# Altium project CW330_NewKintexFPGA.PrjPcb (part 1 of 5)
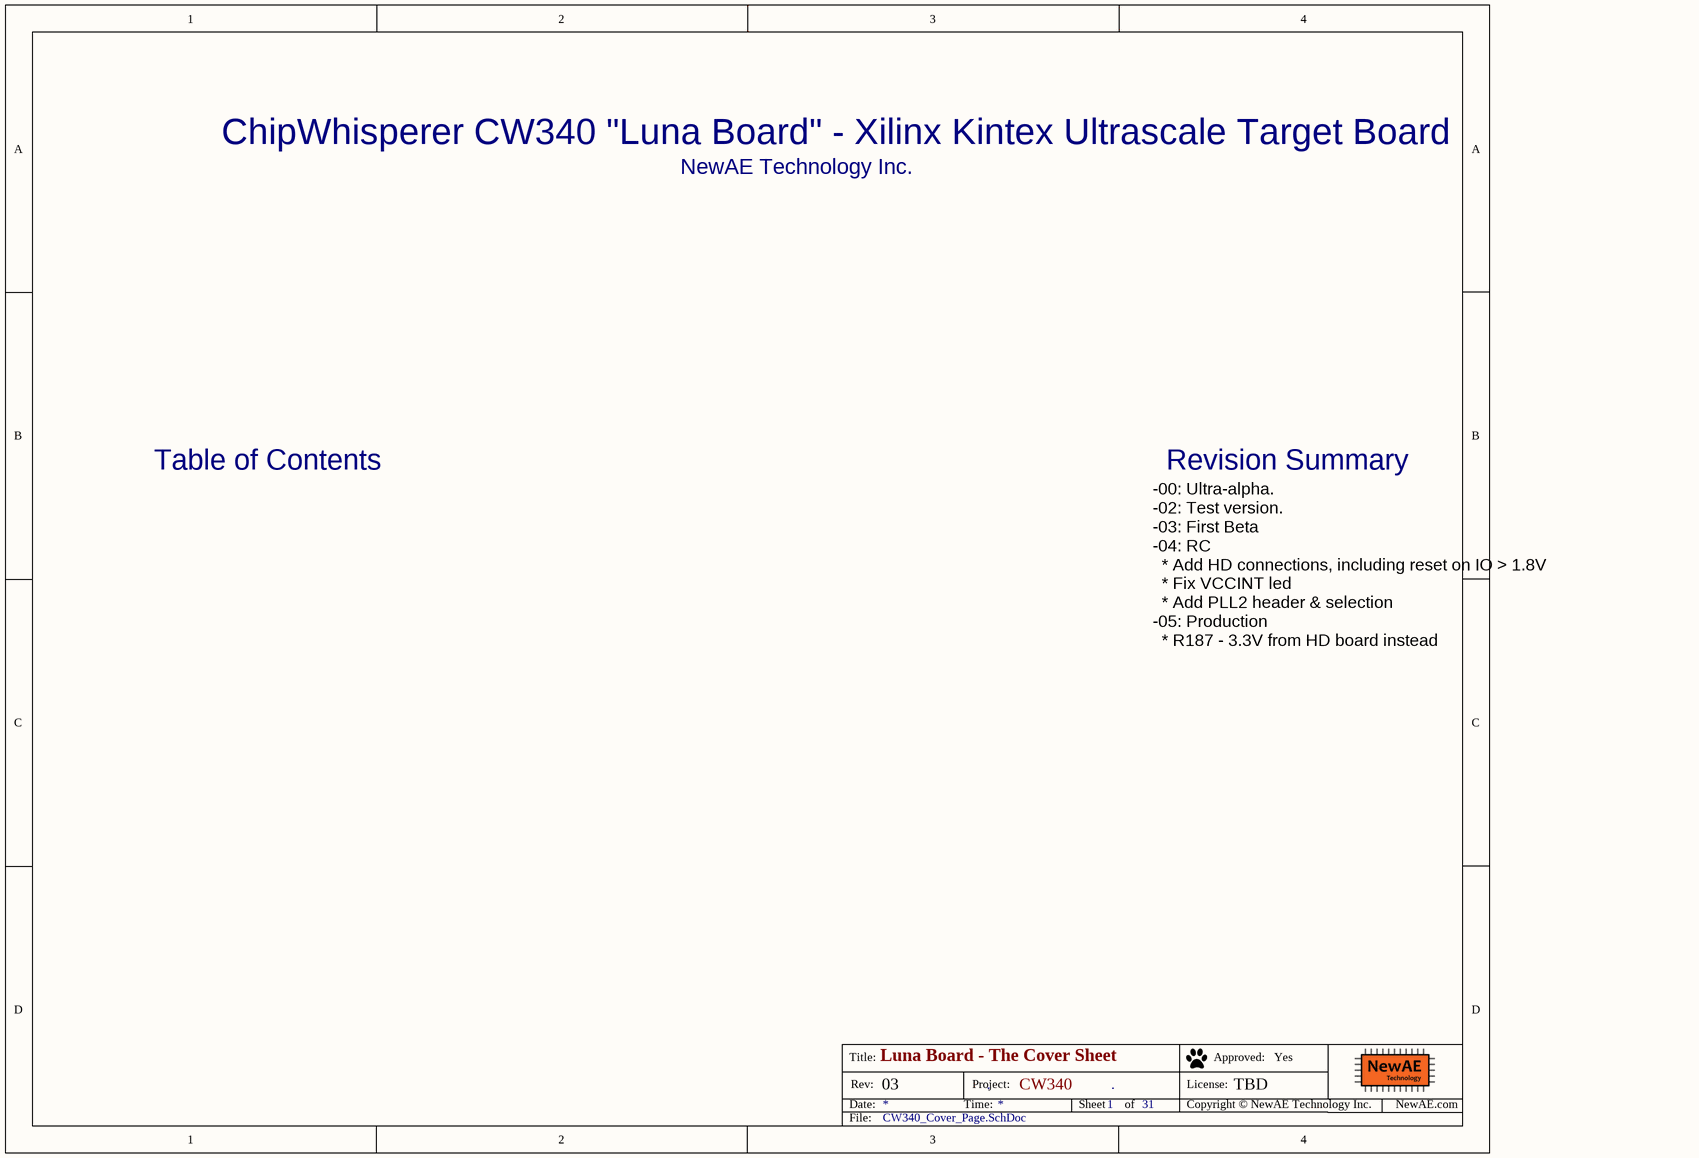
[diagram p0: CW340_Cover_Page.SchDoc]
PrjLicense: TBD; PrjName: CW340; PrjRev: 03
26 sheets, 651 parts. Net scope: global (net labels, ports and power ports of the same name join across sheets).
Board file: NAE_CW340_KintexFPGA.PcbDoc
Sheets:
  CW340_Cover_Page.SchDoc
  CW340_Block_Diagram.SchDoc
  CW340_FPGA_CFG.SchDoc
  CW340_Clocks.SchDoc
  CW340_FPGA_XADC.SchDoc
  CW340_HEATSINK_FAN.SchDoc
  CW340_INPUT_POWER.SchDoc
  CW340_PSU_VCCIO.SchDoc
  CW340_PSU_VCCAUX.SchDoc
  CW340_USBHUB.SchDoc
  CW340_USBHUB_ExtPorts.SchDoc
  CW340_SAM3X_MAIN.SchDoc
  CW340_SAM3X_PWR.SchDoc
  CW340_SAM3X_MISC.SchDoc
  CW340_SAM3X_USB.SchDoc
  CW340_STATUS_LEDs.SchDoc
  CW340_USERIO_debug.SchDoc
  CW340_USERIO_Header.SchDoc
  CW340_USERIO_USB.SchDoc
  CW340_USERIO_SerialSelections.SchDoc
  CW340_USERIO_Breakout.SchDoc
  CW340_SPI_flashes.SchDoc
  CW340_EdgeConnector.SchDoc
  CW340_HyperDebug.SchDoc
  CW340_FTDI.SchDoc
  CW340_FTDI_LevelShifting.SchDoc

## Sheet CW340_Cover_Page.SchDoc: Luna Board - The Cover Sheet
size Letter; DocumentNumber: .; Revision: .; SheetNumber: 1; SheetTotal: 31; SheetApproved: Yes

### Notes on the sheet
- ChipWhisperer CW340 "Luna Board" - Xilinx Kintex Ultrascale Target Board
- NewAE Technology Inc.
- Table of Contents
- Revision Summary
- -00: Ultra-alpha.
  -02: Test version.
  -03: First Beta
  -04: RC
  * Add HD connections, including reset on IO > 1.8V
  * Fix VCCINT led
  * Add PLL2 header & selection
  -05: Production
  * R187 - 3.3V from HD board instead
- Title:
- Date:
- Rev:
- Time:
- Project:
- Sheet
- of
- License:
- Copyright © NewAE Technology Inc.
- Approved:
- NewAE.com
- File:

## Sheet CW340_Block_Diagram.SchDoc: Block Diagram
size Letter; SheetNumber: 2; SheetTotal: 31
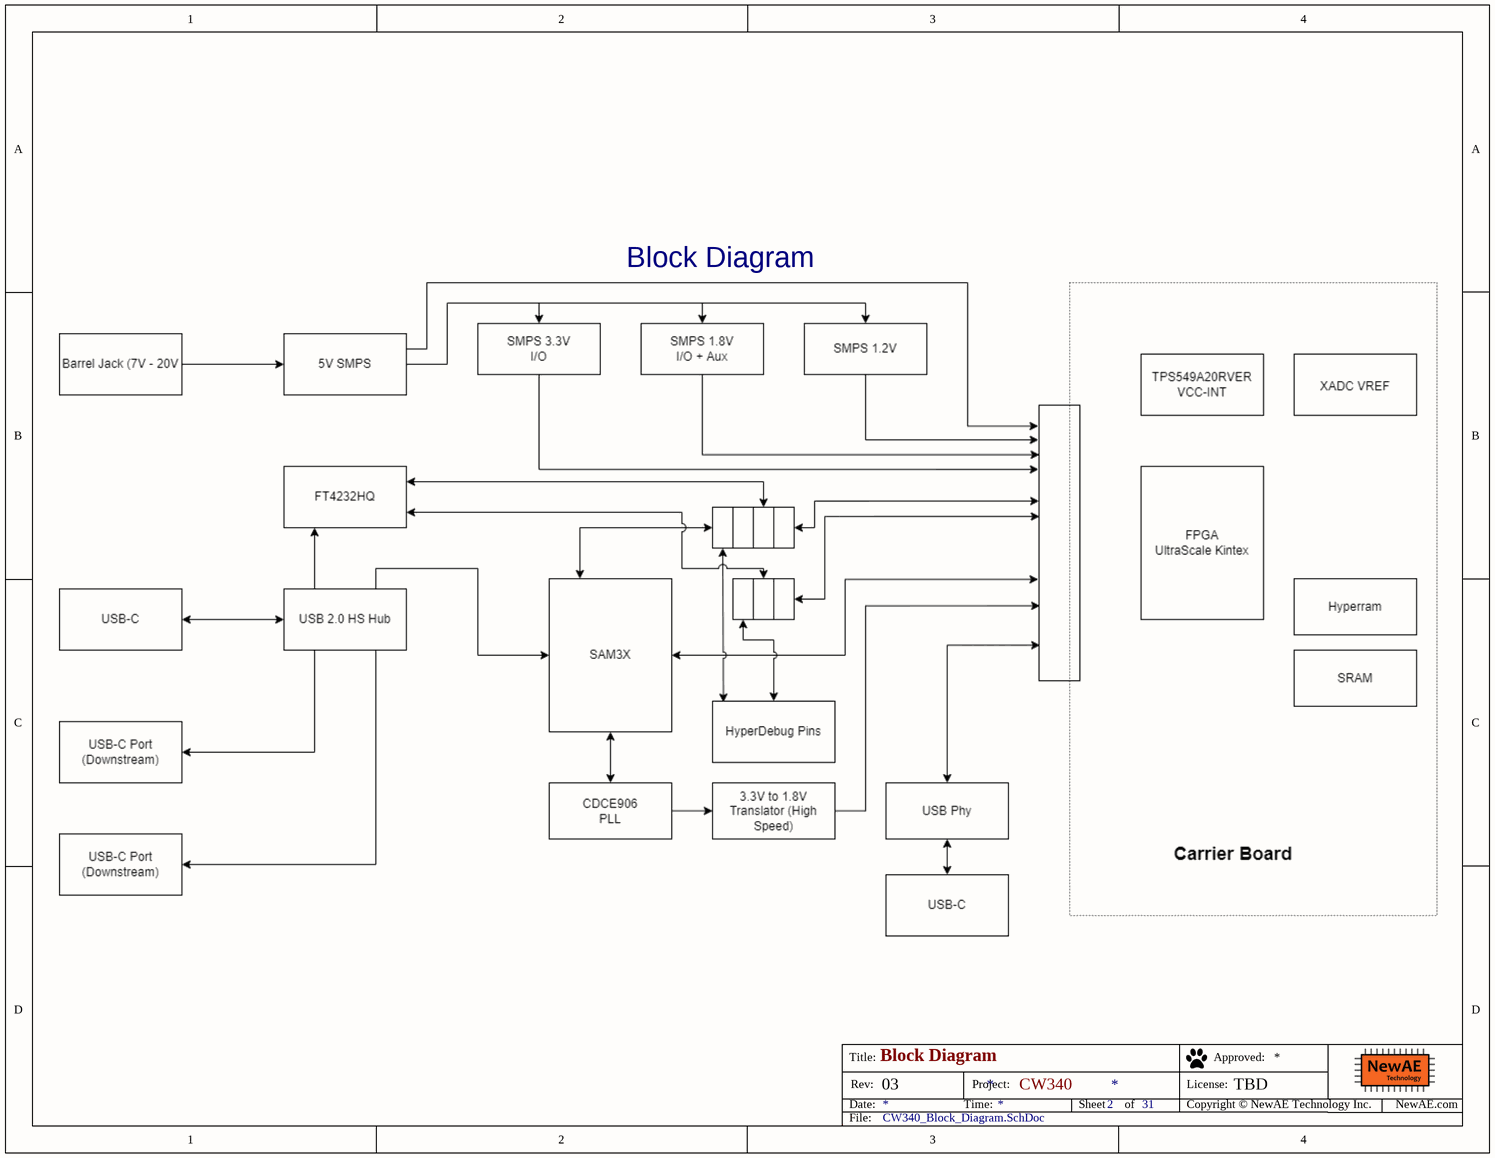
[diagram p1: CW340_Block_Diagram.SchDoc]

### Notes on the sheet
- Block Diagram
- Title:
- Date:
- Rev:
- Time:
- Project:
- Sheet
- of
- License:
- Copyright © NewAE Technology Inc.
- Approved:
- NewAE.com
- File:

## Sheet CW340_FPGA_CFG.SchDoc: Configuration Routing
size Letter; Organization: NewAE Technology Inc.; Address1: 1083 Queen St., Suite 196; Address2: Halifax; Address3: NS; Address4: Canada B3H 0B2; DocumentNumber: .; Revision: .; SheetNumber: 16; SheetTotal: 31; SheetApproved: NO
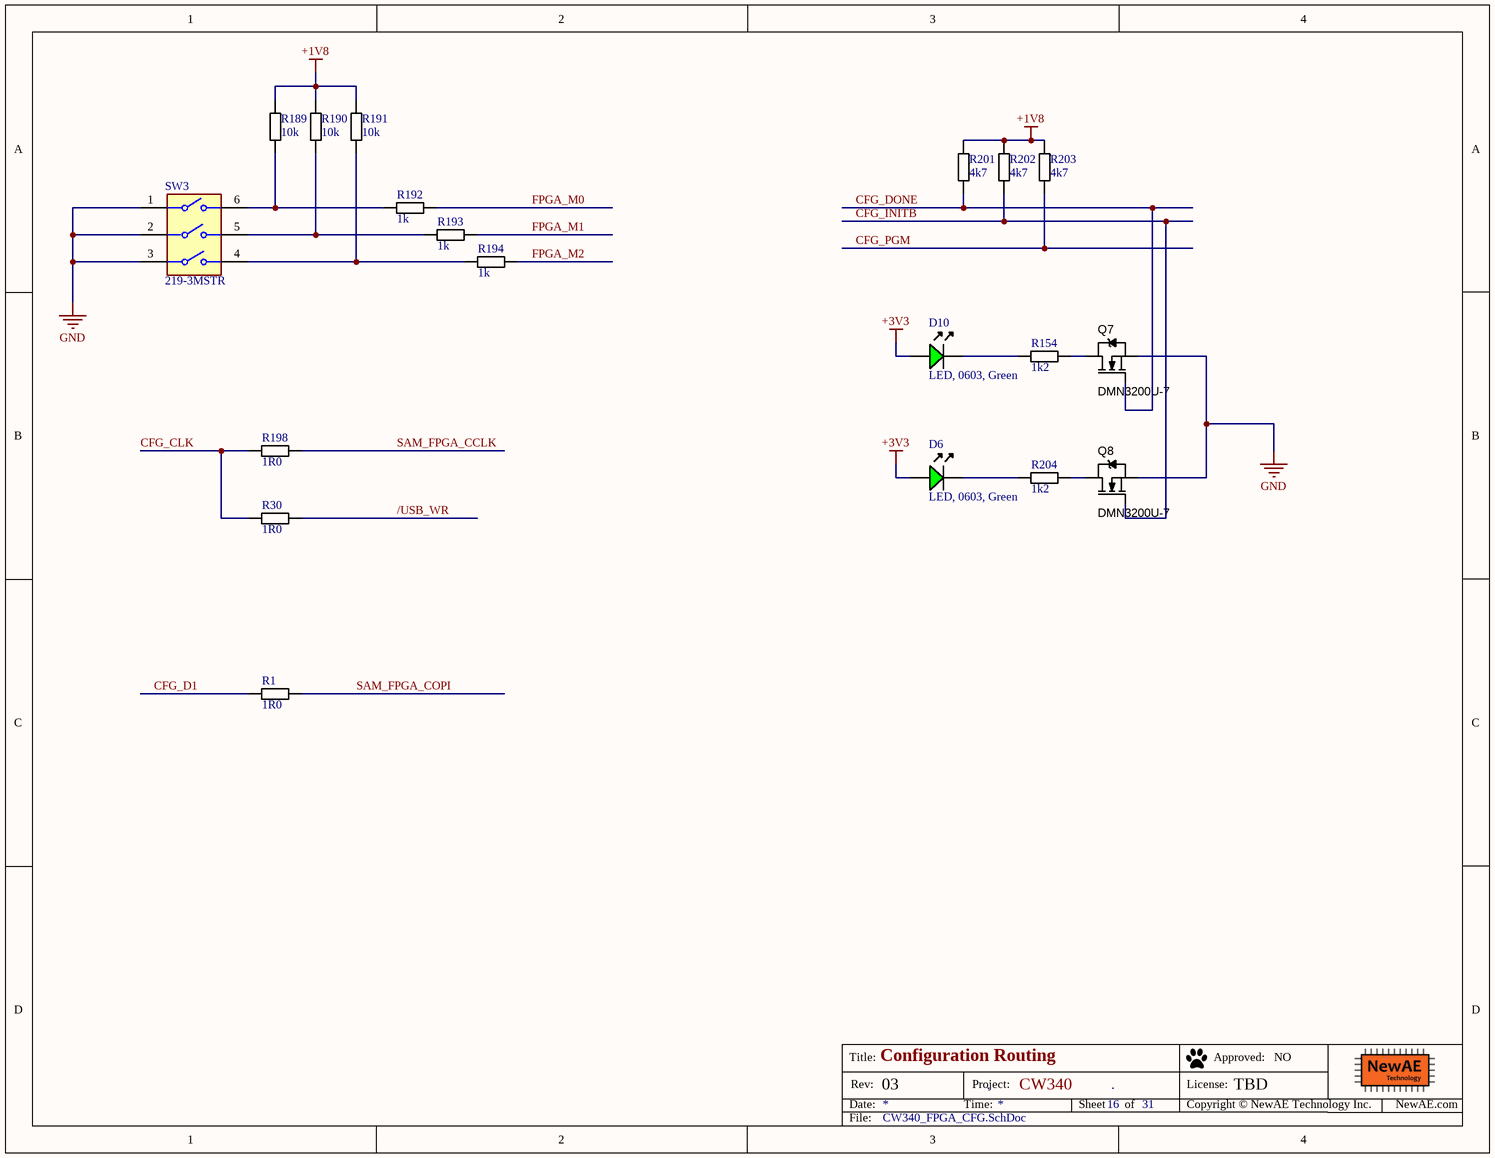
[diagram p2: CW340_FPGA_CFG.SchDoc]

### Parts
D6  LED, 0603, Green  [LED-0603-GREEN]
D10  LED, 0603, Green  [LED-0603-GREEN]
Q7  DMN3200U-7  [SOT95P245X110-3M]
Q8  DMN3200U-7  [SOT95P245X110-3M]
R1  1R0  [RESC1608X55N]
R30  1R0  [RESC1608X55N]
R154  1k2  [RESC1005X40N]
R189  10k  [RESC1005X40N]
R190  10k  [RESC1005X40N]
R191  10k  [RESC1005X40N]
R192  1k  [RESC1005X40N]
R193  1k  [RESC1005X40N]
R194  1k  [RESC1005X40N]
R198  1R0  [RESC1608X55N]
R201  4k7  [RESC1005X40N]
R202  4k7  [RESC1005X40N]
R203  4k7  [RESC1005X40N]
R204  1k2  [RESC1005X40N]
SW3  219-3MSTR  [FP-219-3MSTR-MFG]

### Nets
+1V8: R189.1 R190.1 R191.1 R201.1 R202.1 R203.1
+3V3: D6.A D10.A
GND: Q7.2(S) Q8.2(S) SW3.1 SW3.2 SW3.3
/USB_WR: R30.2
CFG_CLK: R30.1 R198.1
CFG_D1: R1.1
CFG_DONE: Q7.1(G) R201.2
CFG_INITB: Q8.1(G) R202.2
CFG_PGM: R203.2
FPGA_M0: R192.2
FPGA_M1: R193.2
FPGA_M2: R194.2
SAM_FPGA_CCLK: R198.2
SAM_FPGA_COPI: R1.2
NetD6_K: D6.K R204.1
NetD10_K: D10.K R154.1
NetQ7_3: Q7.3(D) R154.2
NetQ8_3: Q8.3(D) R204.2
NetR189_2: R189.2 R192.1 SW3.6
NetR190_2: R190.2 R193.1 SW3.5
NetR191_2: R191.2 R194.1 SW3.4

### Notes on the sheet
- Title:
- Date:
- Rev:
- Time:
- Project:
- Sheet
- of
- License:
- Copyright © NewAE Technology Inc.
- Approved:
- NewAE.com
- File:

### Library data of the parts
D6 D10 = LEDCHIP_0603_GREEN: Chip LED, Green; Manufacture 1: Kingbright; Manufacture Part Number 1: APT1608CGCK; Component Group: Optical; PP Material Stack: 16; PP Rotation: -90; Part Number: LEDCHIP_0603_GREEN; Pin Count: 2; Supplier 1: Digi-Key; Supplier Part Number 1: 754-1116-1-ND; Mounting Technology: SMT; Component Kind: Standard; Component Type: Standard
Q7 Q8 = DMN3200U-7: MOSFET N-CH 30V 2.2A SOT23-3; Manufacture 1: Diodes Inc.; Rated Power: 3A; PP Material Stack: 0; Part Number: DMN3200U-7; Component Group: MOSFET; Footprint: SOT23; Manufacture Part Number 1: DMN3200U-7; Pin Count: 3; Supplier 1: Digi-Key; Supplier Part Number 1: DMN3200U-7DICT-ND; Rated Voltage: 30V; Mounting Technology: SMT; RoHS: Yes; Component Kind: Standard; Component Type: Standard; PP Rotation: 0
R1 R30 R198 = RCHIP-1R0-0603: 1R0 res, 0603, 1%, 1/10W; Manufacture 1: Yageo; Manufacture Part Number 1: RC0603FR-071RL; Component Group: Resistor; Case-EIA: 0603; Case-Metric: 1608; Rated Power: 0.1W; Rated Voltage: 75VDC; Part Number: RCHIP-1R0-0603; Footprint: 0603; Pin Count: 2; Supplier 1: Digi-Key; Supplier Part Number 1: 311-1.00HRCT-ND; Value: 1R0; Tolerance: 1%; Mounting Technology: SMT; Temperature Range: -55C to 155C; Component Kind: Standard; Component Type: Standard
R154 R204 = RCHIP-1K2-0402: 1k2 res, 0402, 1%, 1/16W; Manufacture 1: Yageo; Manufacture Part Number 1: RC0402FR-071K2L; Component Group: Resistor; Case-EIA: 0402; Case-Metric: 1005; Rated Power: 0.063W; Rated Voltage: 75VDC; Part Number: RCHIP-1K2-0402; Footprint: 0402; Pin Count: 2; Supplier 1: Digi-Key; Supplier Part Number 1: 311-1.20KLRCT-ND; Value: 1k2; Tolerance: 1%; Mounting Technology: SMT; Temperature Range: -55C to 155C; Component Kind: Standard; Component Type: Standard
R189-R191 = RCHIP-10K-0402: 10k res, 0402, 1%, 1/16W; Manufacture 1: Yageo; Manufacture Part Number 1: RC0402FR-0710KL; Component Group: Resistor; Case-EIA: 0402; Case-Metric: 1005; Rated Power: 0.063W; Rated Voltage: 75VDC; Part Number: RCHIP-10K-0402; Footprint: 0402; Pin Count: 2; Supplier 1: Digi-Key; Supplier Part Number 1: 311-10.0KLRCT-ND; Value: 10k; Tolerance: 1%; Mounting Technology: SMT; Temperature Range: -55C to 155C; Component Kind: Standard; Component Type: Standard
R192-R194 = RCHIP-1K-0402: 1k res, 0402, 1%, 1/16W; Manufacture 1: Yageo; Manufacture Part Number 1: RC0402FR-071KL; Component Group: Resistor; Case-EIA: 0402; Case-Metric: 1005; Rated Power: 0.063W; Rated Voltage: 75VDC; Part Number: RCHIP-1K-0402; Footprint: 0402; Pin Count: 2; Supplier 1: Digi-Key; Supplier Part Number 1: 311-1.00KLRCT-ND; Value: 1k; Tolerance: 1%; Mounting Technology: SMT; Temperature Range: -55C to 155C; Component Kind: Standard; Component Type: Standard
R201-R203 = RCHIP-4K7-0402: 4k7 res, 0402, 1%, 1/16W; Manufacture 1: Yageo; Manufacture Part Number 1: RC0402FR-074K7L; Component Group: Resistor; Case-EIA: 0402; Case-Metric: 1005; Rated Power: 0.063W; Rated Voltage: 75VDC; Part Number: RCHIP-4K7-0402; Footprint: 0402; Pin Count: 2; Supplier 1: Digi-Key; Supplier Part Number 1: 311-4.7KLRCT-ND; Value: 4k7; Tolerance: 1%; Mounting Technology: SMT; Temperature Range: -55C to 155C; Component Kind: Standard; Component Type: Standard
SW3 = CMP-07018-000004-1: SWITCH SLIDE DIP SPST 100MA 20V; Washable: Yes; Mechanical Life: 2000Cycles; Number of Positions: 3; Pitch: 0.1inch; Actuator Type: Slide (Standard); Max Operating Temperature: 85°C; Voltage Rating (DC): 20V; Termination: Gull Wing; Length: 0.358inch; Min Operating Temperature: -55°C; Orientation: Straight; Mount: Surface Mount; Package Quantity: 1000; Current Rating: 100mA; Electrical Life: 2000Cycles; Max Current Rating: 100mA; Throw Configuration: SPST; Contact Material: Copper; Packaging: Tape and Reel; Contact Plating: Gold; Lead Free: Lead Free; Max Voltage Rating (DC): 20V

## Sheet CW340_Clocks.SchDoc: PLL, Clocks for FPGA
size Letter; DocumentNumber: .; Revision: .; SheetNumber: 29; SheetTotal: 31; SheetApproved: NO
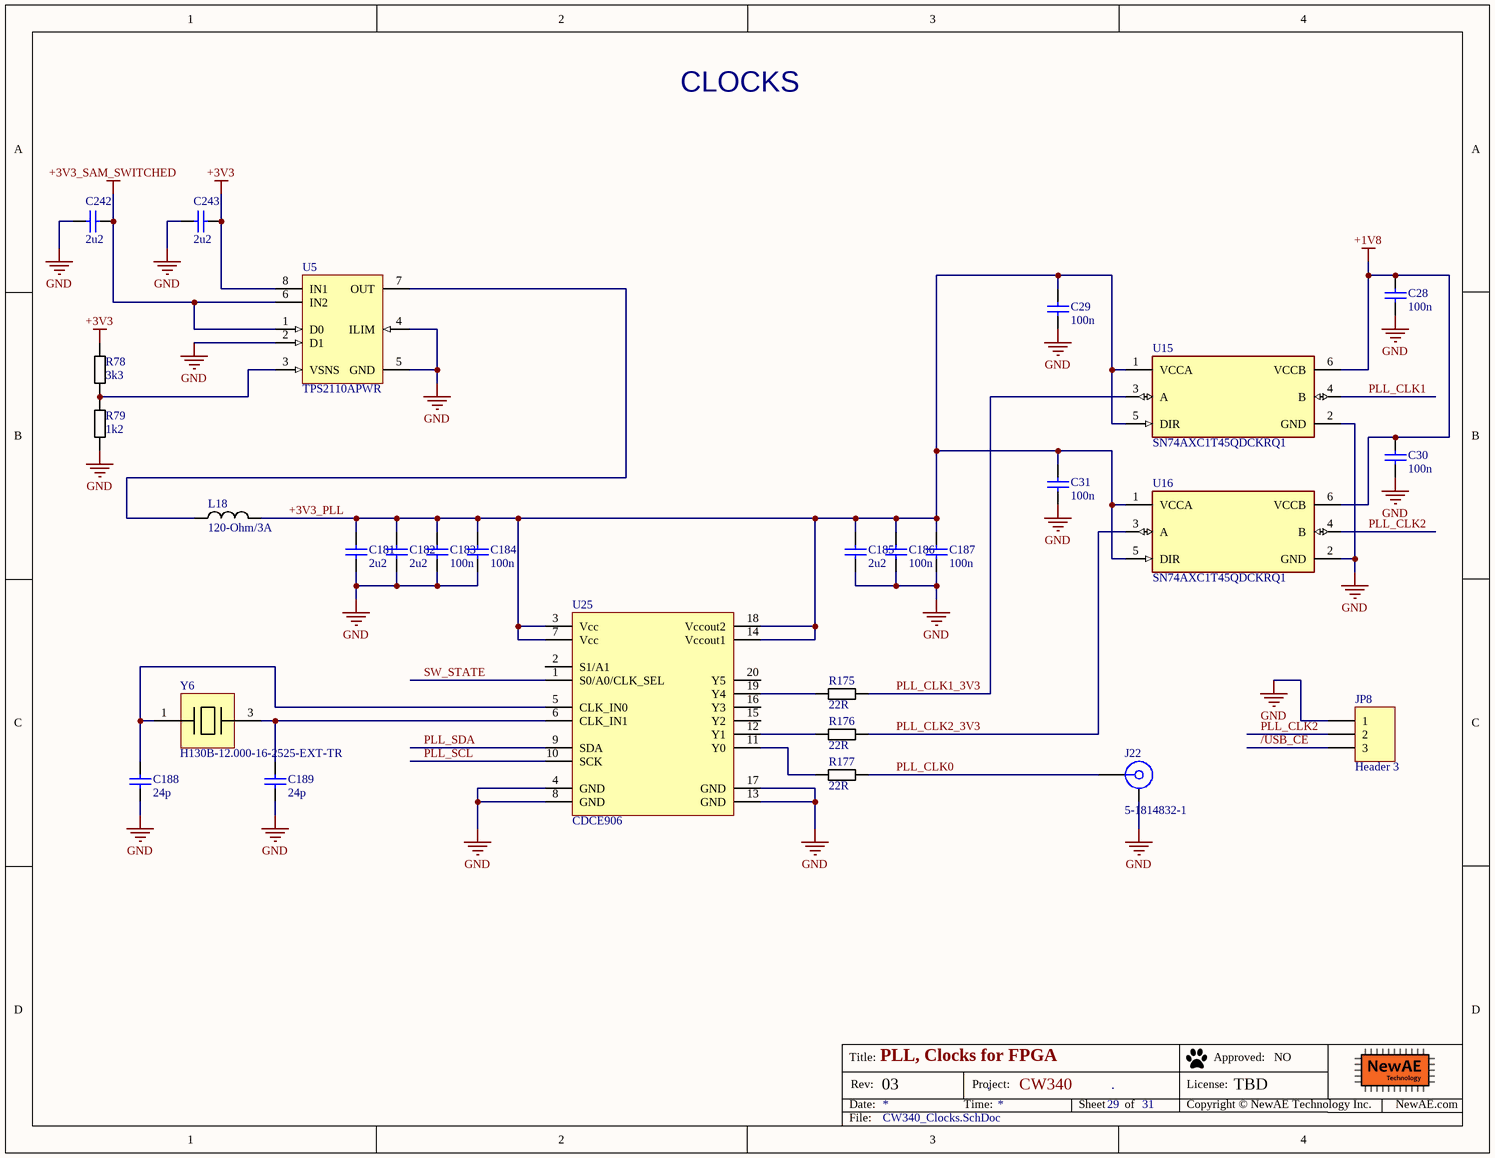
[diagram p3: CW340_Clocks.SchDoc]

### Parts
C28  100n  [CAPC0402_M]
C29  100n  [CAPC0402_M]
C30  100n  [CAPC0402_M]
C31  100n  [CAPC0402_M]
C181  2u2  [CAPC0603_M]
C182  2u2  [CAPC0603_M]
C183  100n  [CAPC0402_M]
C184  100n  [CAPC0402_M]
C185  2u2  [CAPC0603_M]
C186  100n  [CAPC0402_M]
C187  100n  [CAPC0402_M]
C188  24p  [CAPC0402_M]
C189  24p  [CAPC0402_M]
C242  2u2  [CAPC0603_M]
C243  2u2  [CAPC0603_M]
J22  5-1814832-1  [SMA_VERT_1.65MMHOLE]
JP8  Header 3  [HDR1X3]
L18  120-Ohm/3A  [IND_0603]
R78  3k3  [RESC1005X40N]
R79  1k2  [RESC1005X40N]
R175  22R  [RESC1005X40N]
R176  22R  [RESC1005X40N]
R177  22R  [RESC1005X40N]
U5  TPS2110APWR  [PW0008A_L]
U15  SN74AXC1T45QDCKRQ1  [FP-DCK0006A-MFG]
U16  SN74AXC1T45QDCKRQ1  [FP-DCK0006A-MFG]
U25  CDCE906  [TSSOP065-20-PW]
Y6  H130B-12.000-16-2525-EXT-TR  [5x3.2mm XTAL]

### Nets
+1V8: C28.1 C30.1 U15.6(VCCB) U16.6(VCCB)
+3V3: C243.2 R78.1 U5.8(IN1)
+3V3_SAM_SWITCHED: C242.2 U5.1(D0) U5.6(IN2)
GND: C28.2 C29.2 C30.2 C31.2 C181.2 C182.2 C183.2 C184.2 C185.2 C186.2 C187.2 C188.2 C189.2 C242.1 C243.1 J22.MH JP8.1 R79.2 U5.2(D1) U5.4(ILIM) U5.5(GND) U15.2(GND) U16.2(GND) U25.4(GND) U25.8(GND) U25.13(GND) U25.17(GND)
+3V3_PLL: C29.1 C31.1 C181.1 C182.1 C183.1 C184.1 C185.1 C186.1 C187.1 L18.2 U15.1(VCCA) U15.5(DIR) U16.1(VCCA) U16.5(DIR) U25.3(Vcc) U25.7(Vcc) U25.14(Vccout1) U25.18(Vccout2)
/USB_CE: JP8.3
PLL_CLK0: J22.1 R177.2
PLL_CLK1: U15.4(B)
PLL_CLK1_3V3: R175.2 U15.3(A)
PLL_CLK2: JP8.2 U16.4(B)
PLL_CLK2_3V3: R176.2 U16.3(A)
PLL_SCL: U25.10(SCK)
PLL_SDA: U25.9(SDA)
SW_STATE: U25.1(S0/A0/CLK_SEL)
NetC188_1: C188.1 U25.5(CLK_IN0) Y6.1
NetC189_1: C189.1 U25.6(CLK_IN1) Y6.3
NetL18_1: L18.1 U5.7(OUT)
NetR78_2: R78.2 R79.1 U5.3(VSNS)
NetR175_1: R175.1 U25.19(Y4)
NetR176_1: R176.1 U25.12(Y1)
NetR177_1: R177.1 U25.11(Y0)

Not connected (* = marked no-connect by the designer): U25 2(S1/A1) 15(Y2) 16(Y3) 20(Y5)

### Notes on the sheet
- CLOCKS
- Title:
- Date:
- Rev:
- Time:
- Project:
- Sheet
- of
- License:
- Copyright © NewAE Technology Inc.
- Approved:
- NewAE.com
- File:

### Library data of the parts
C28-C31 C183 C184 C186 C187 = CCHIP-100n-0402: 100n, 0402; Manufacture Part Number 1: CGA2B3X7R1V104K050BB; Component Group: Capacitor; Case-EIA: 0402; Part Number: CCHIP-100n-0402; Footprint: 0402; Pin Count: 2; Value: 100n; Mounting Technology: SMT; Component Kind: Standard; Component Type: Standard; Supplier 1: Digi-Key; Supplier Part Number 1: 445-6901-1-ND
C181 C182 C185 C242 C243 = CCHIP-2u2-0603-16V: 2u2, 0603; Manufacture 1: Taiyo Yuden; Manufacture Part Number 1: EMK107BJ225KA-T; Component Group: Capacitor; Case-EIA: 0603; Case-Metric: 1608; Rated Voltage: 16VDC; Part Number: CCHIP-2u2-0603-16V; Footprint: 0603; Pin Count: 2; Supplier 1: Digi-Key; Supplier Part Number 1: 587-1430-1-ND; Value: 2u2; Mounting Technology: SMT; Component Kind: Standard; Component Type: Standard
C188 C189 = CCHIP-24p-0402: 24p, 0402; Manufacture 1: Murata Electronics; Manufacture Part Number 1: GCM1555C1H240FA16D; Component Group: Capacitor; Case-EIA: 0402; Case-Metric: 1005; Rated Voltage: 50V; Part Number: CCHIP-24p-0402; Footprint: 0402; Pin Count: 2; Supplier 1: Digi-Key; Supplier Part Number 1: 490-GCM1555C1H240FA16DTR-ND; Value: 24p; Mounting Technology: SMT; RoHS: Yes; Component Kind: Standard; Component Type: Standard
J22 = 5-1814832-1: SMA, Vert; Manufacture 1: TE Connectivity; Component Group: Connector; Part Number: 5-1814832-1; Manufacture Part Number 1: 5-1814832-1; Pin Count: 2; Supplier 1: Digi-Key; Supplier Part Number 1: A97594-ND; Component Kind: Standard; Component Type: Standard
JP8 = Header 3: Header, 3-Pin; LatestRevisionDate: 17-Jul-2002; LatestRevisionNote: Re-released for DXP Platform.; Publisher: Altium Limited
L18 = FBCHIP-120R-0603: 120 Ohm @ 100 MHz, 3A rated FB; Manufacture 1: Murata Electronics; Manufacture Part Number 1: BLM18SG121TN1D; Component Group: Inductor; Value: 120R/3A; Case-EIA: 0603; Case-Metric: 1680; PP Material Stack: 0; Part Number: FBCHIP-120R-0603; Footprint: 0603; Pin Count: 2; Supplier 1: Digi-Key; Supplier Part Number 1: 490-3996-1-ND; Rated Power: 3A; Component Kind: Standard; Component Type: Standard; PP Rotation: 0
R78 = RCHIP-3K3-0402: 3k3 res, 0402, 1%, 1/16W; Manufacture 1: Yageo; Manufacture Part Number 1: RC0402FR-073K3L; Component Group: Resistor; Case-EIA: 0402; Case-Metric: 1005; Rated Power: 0.063W; Rated Voltage: 75VDC; Part Number: RCHIP-3K3-0402; Footprint: 0402; Pin Count: 2; Supplier 1: Digi-Key; Supplier Part Number 1: 311-3.30KLRCT-ND; Value: 3k3; Tolerance: 1%; Mounting Technology: SMT; Temperature Range: -55C to 155C; Component Kind: Standard; Component Type: Standard
R79 = RCHIP-1K2-0402: as R154 on sheet CW340_FPGA_CFG; Part Number: RCHIP-1K2-0402; Footprint: 0402; Pin Count: 2; Supplier 1: Digi-Key; Supplier Part Number 1: 311-1.20KLRCT-ND; Value: 1k2; Tolerance: 1%; Mounting Technology: SMT; Temperature Range: -55C to 155C; Component Kind: Standard; Component Type: Standard
R175-R177 = RCHIP-22R-0402: 22R res, 0402, 1%, 1/16W; Manufacture 1: Yageo; Manufacture Part Number 1: RC0402FR-0722RL; Component Group: Resistor; Case-EIA: 0402; Case-Metric: 1005; Rated Power: 0.063W; Rated Voltage: 75VDC; Part Number: RCHIP-22R-0402; Footprint: 0402; Pin Count: 2; Supplier 1: Digi-Key; Supplier Part Number 1: 311-22.0LRCT-ND; Value: 22R; Tolerance: 1%; Mounting Technology: SMT; Temperature Range: -55C to 155C; Component Kind: Standard; Component Type: Standard
U5 = CMP-0339-00059-2: Dual In / Single Out Autoswitching Power Mux, 2.8 to 5.5 V, -40 to 85 degC, 8-pin TSSOP (PW), Green (RoHS & no Sb/Br); Manufacturer: Texas Instruments; SubFamily: Power Multiplexer (MUX); Number of Inputs: 2; IN2 Output Current(Max)(A): 0.75; IN1 rDS(on)(Typ)(mOhm): 120; IN1, IN2 Input Voltage(Max)(V): 5.5; IN2 rDS(on)(Typ)(Ohms): 0.12; IN1, IN2 Input Voltage(Min)(V): 2.8; PackageReference: PW0008A; ComponentLink1URL: http://www.ti.com/general/docs/lit/getliterature.tsp?genericPartNumber=TPS2110A&fileType=pdf; ComponentLink1Description: Datasheet; PackageDescription: 8-Pin Plastic Thin Small Outline Package 3 x 4.4 mm Body ,0.65 mm Pitch; Eco-Plan: Green (RoHS & no Sb/Br); PartNumber: TPS2110APWR; PackageVersion: revG, Feb-2011; Code_JEDEC: MO-153; IN1 Output Current(Max)(A): 0.75; Mounting Technology: Surface Mount; DatasheetVersion: SBVS043A
U15 U16 = CMP-04899-000038-1: IC LOGIC BUFFER/DRIVER
U25 = CDCE906PW: IC 3-PLL SYNTH/MULT/DIV 20-TSSOP; Manufacture 1: Texas Instruments; Component Group: Digital IC; PP Material Stack: 0; Part Number: CDCE906PW; Footprint: 20-TSSOP; Manufacture Part Number 1: CDCE906PW; Pin Count: 20; Supplier 1: Digi-Key; Supplier Part Number 1: 296-20675-5-ND; Mounting Technology: SMT; RoHS: Yes; Component Kind: Standard; Component Type: Standard; PP Rotation: 0
Y6 = H130B-12.000-16-2525-EXT-TR: 12MHz ±25ppm Crystal 16pF 35 Ohms 4-SMD, No Lead; Manufacture 1: Raltron Electronics; Value: 12.000MHz; PP Material Stack: 0; Supplier 1: Digi-Key; Stock 1: 4955; Pricing 1: 1=0.590000, 10=0.488000, 50=0.439400, 100=0.390600, 500=0.371100 (USD); Supplier Part Number 1: 2151-H130B-12.000-16-2525-EXT-TR-ND; .Checked SCH: *; .Checked PCB: *; Manufacturer Part Number: H130B-12.000-16-2525-EXT-TR; Part Number: H130B-12.000-16-2525-EXT-TR; Component Group: Crystal; Footprint: TBD; Manufacture Part Number 1: H130B-12.000-16-2525-EXT-TR; Pin Count: 4; Mounting Technology: SMT; Component Kind: Standard; Component Type: Standard; PP Rotation: 0

## Sheet CW340_FPGA_XADC.SchDoc: FPGA - Thermal + XADC
size Letter; DocumentNumber: .; Revision: .; SheetNumber: 17; SheetTotal: 31; SheetApproved: Yes
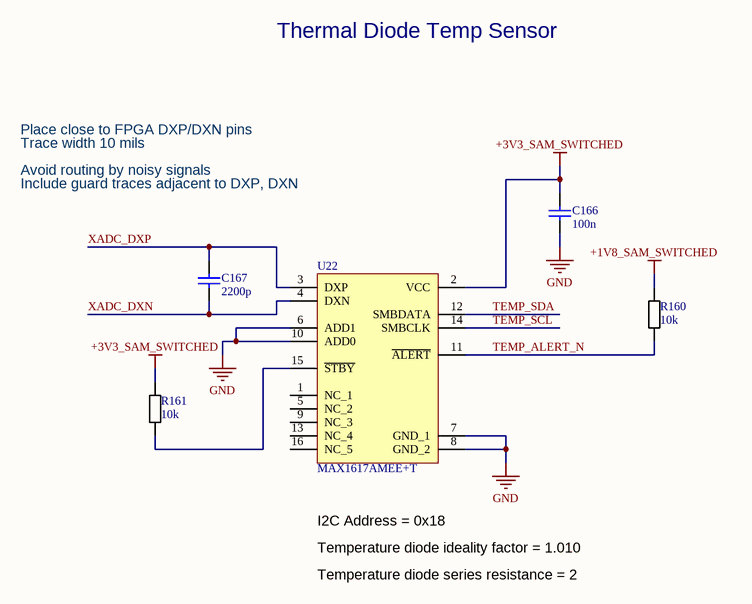
[diagram p4: CW340_FPGA_XADC.SchDoc]

### Parts
C166  100n  [CAPC0402_M]
C167  2200p  [CAPC0402_M]
R160  10k  [RESC1005X40N]
R161  10k  [RESC1005X40N]
U22  Temp Diode sensor interface  [SOP64P600X175-16N]  (value not drawn)

### Nets
+1V8_SAM_SWITCHED: R160.1
+3V3_SAM_SWITCHED: C166.1 R161.1 U22.2(VCC)
GND: C166.2 U22.6(ADD1) U22.7(GND_1) U22.8(GND_2) U22.10(ADD0)
TEMP_ALERT_N: R160.2 U22.11(~{ALERT})
TEMP_SCL: U22.14(SMBCLK)  [project net PLL_SCL]
TEMP_SDA: U22.12(SMBDATA)  [project net PLL_SDA]
XADC_DXN: C167.2 U22.4(DXN)
XADC_DXP: C167.1 U22.3(DXP)
NetR161_2: R161.2 U22.15(~{STBY})

Not connected (* = marked no-connect by the designer): U22 1(NC_1) 5(NC_2) 9(NC_3) 13(NC_4) 16(NC_5)

### Notes on the sheet
- Thermal Diode Temp Sensor
- Trace width 10 mils
- Place close to FPGA DXP/DXN pins
- Include guard traces adjacent to DXP, DXN
- Avoid routing by noisy signals
- I2C Address = 0x18
- Temperature diode ideality factor = 1.010
- Temperature diode series resistance = 2
- Title:
- Date:
- Rev:
- Time:
- Project:
- Sheet
- of
- License:
- Copyright © NewAE Technology Inc.
- Approved:
- NewAE.com
- File:

### Library data of the parts
C166 = CCHIP-100n-0402: as C28 on sheet CW340_Clocks; Part Number: CCHIP-100n-0402; Footprint: 0402; Pin Count: 2; Value: 100n; Mounting Technology: SMT; Component Kind: Standard; Component Type: Standard; Supplier 1: Digi-Key; Supplier Part Number 1: 445-6901-1-ND
C167 = CCHIP-2200P-0402-50V: CAP CER 2200PF 50V X7R 0402; Manufacture 1: Taiyo Yuden; Manufacture Part Number 1: UMK105B7222KV-F; Component Group: Capacitor; Case-EIA: 0402; Case-Metric: 1005; Tolerance: ±10%; PP Material Stack: 0; Part Number: CCHIP-2200P-0402-50V; Footprint: 0402; Pin Count: 2; Supplier 1: Digi-Key; Supplier Part Number 1: 587-1221-1-ND; Value: 2200p; Rated Voltage: 50V; Mounting Technology: SMT; Component Kind: Standard; Component Type: Standard; PP Rotation: 0
R160 R161 = RCHIP-10K-0402: as R189 on sheet CW340_FPGA_CFG; Part Number: RCHIP-10K-0402; Footprint: 0402; Pin Count: 2; Supplier 1: Digi-Key; Supplier Part Number 1: 311-10.0KLRCT-ND; Value: 10k; Tolerance: 1%; Mounting Technology: SMT; Temperature Range: -55C to 155C; Component Kind: Standard; Component Type: Standard
U22 = MAX1617AMEE+T: SENSOR DIGITAL -55C-125C 16QSOP; Manufacture 1: Maxim Integrated; Max Supply Voltage: 5.5V; Min Supply Voltage: 3V; Interface: I2C,SMBus,2-Wire; Resolution: 7b; Operating Supply Current: 120uA; Output Type: Digital,I2C; Component Group: Analog IC; PP Material Stack: 0; Supplier 1: Digi-Key; RoHS: Yes; Category: Temperature and Humidity Sensors; Stock 1: 2966; Pricing 1: 1=8.93000, 10=8.06900, 25=7.69360, 100=6.68030, 500=5.81716, 1000=5.42100 (USD); Case/Package: QSOP; Number of Pins: 16; Contact Plating: Tin,Matte; Min Operating Temperature: -55°C; Max Operating Temperature: 125°C; Package Quantity: 2500; Packaging: Tape and Reel; Max Supply Voltage (DC): 5.5V; Min Supply Voltage (DC): 3V; Radiation Hardening: No; REACH SVHC: Unknown; Lead Free: Lead Free; ComponentLink3URL: https://datasheet.ciiva.com/16635/max1617a-16635403.pdf?src-supplier=Avnet+Europe; ComponentLink3Description: https://datasheet.ciiva.com/16635/max1617a-16635403.pdf?src-supplier=Avnet+Europe; ComponentLink4URL: https://datasheet.ciiva.com/16635/max1617a-16635599.pdf?src-supplier=Avnet+Europe; ComponentLink4Description: https://datasheet.ciiva.com/16635/max1617a-16635599.pdf?src-supplier=Avnet+Europe; .Checked SCH: *; .Checked PCB: *; Supplier Part Number 1: MAX1617AMEE+TTR-ND; Manufacturer Part Number: MAX1617AMEE+T; Part Number: MAX1617AMEE+T; Footprint: QSOP-16; Manufacture Part Number 1: MAX1617AMEE+T; Pin Count: 16; Mounting Technology: SMT; Component Kind: Standard; Component Type: Standard; PP Rotation: 0

## Sheet CW340_HEATSINK_FAN.SchDoc: FAN Headers
size Letter; Organization: NewAE Technology Inc.; Address1: 1083 Queen St., Suite 196; Address2: Halifax; Address3: NS; Address4: Canada B3H 0B2; DocumentNumber: .; Revision: .; SheetNumber: 31; SheetTotal: 31; SheetApproved: Yes
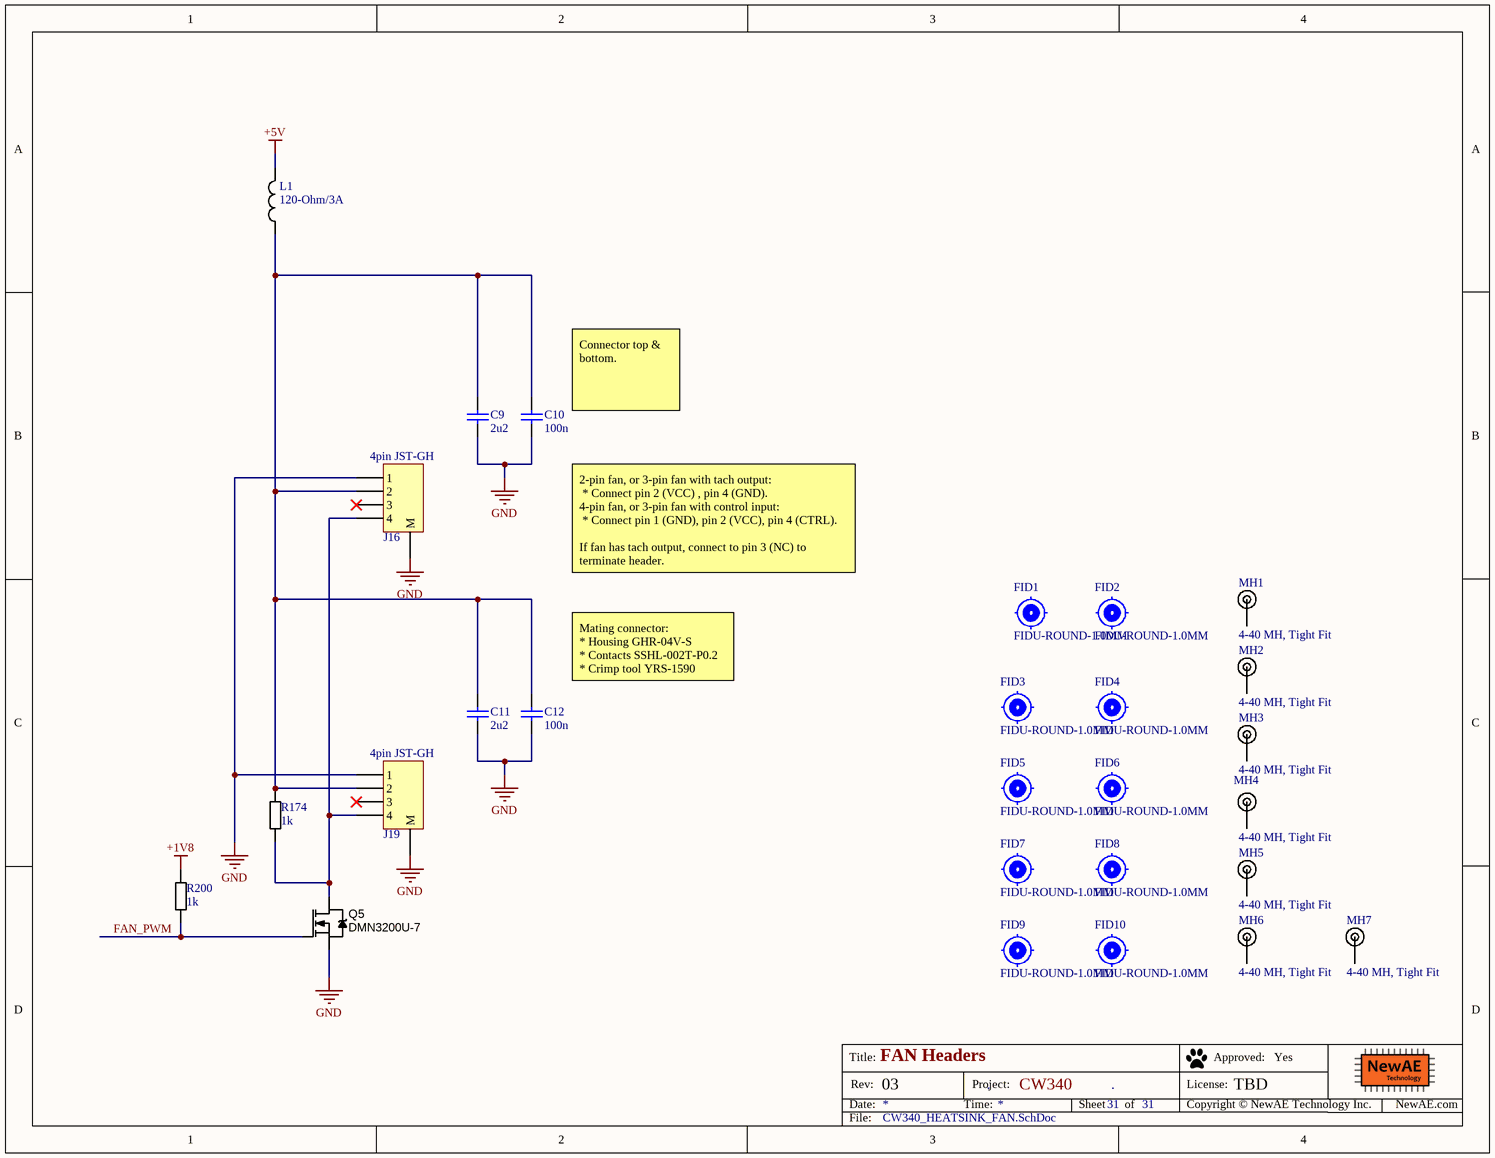
[diagram p5: CW340_HEATSINK_FAN.SchDoc]

### Parts
C9  2u2  [CAPC0603_M]
C10  100n  [CAPC0402_M]
C11  2u2  [CAPC0603_M]
C12  100n  [CAPC0402_M]
FID1  FIDU-ROUND-1.0MM  [FIDU-ROUND-1.0mm]  (no BOM)
FID2  FIDU-ROUND-1.0MM  [FIDU-ROUND-1.0mm]  (no BOM)
FID3  FIDU-ROUND-1.0MM  [FIDU-ROUND-1.0mm]  (no BOM)
FID4  FIDU-ROUND-1.0MM  [FIDU-ROUND-1.0mm]  (no BOM)
FID5  FIDU-ROUND-1.0MM  [FIDU-ROUND-1.0mm]  (no BOM)
FID6  FIDU-ROUND-1.0MM  [FIDU-ROUND-1.0mm]  (no BOM)
FID7  FIDU-ROUND-1.0MM  [FIDU-ROUND-1.0mm]  (no BOM)
FID8  FIDU-ROUND-1.0MM  [FIDU-ROUND-1.0mm]  (no BOM)
FID9  FIDU-ROUND-1.0MM  [FIDU-ROUND-1.0mm]  (no BOM)
FID10  FIDU-ROUND-1.0MM  [FIDU-ROUND-1.0mm]  (no BOM)
J16  4pin JST-GH  [BM04B-GHS-TBT]
J19  4pin JST-GH  [BM04B-GHS-TBT]
L1  120-Ohm/3A  [IND_0603]
MH1  4-40 MH, Tight Fit  [MOUNT_#4_TIGHT]
MH2  4-40 MH, Tight Fit  [MOUNT_#4_TIGHT]
MH3  4-40 MH, Tight Fit  [MOUNT_#4_TIGHT]
MH4  4-40 MH, Tight Fit  [MOUNT_#4_TIGHT]
MH5  4-40 MH, Tight Fit  [MOUNT_#4_TIGHT]
MH6  4-40 MH, Tight Fit  [MOUNT_#4_TIGHT]
MH7  4-40 MH, Tight Fit  [MOUNT_#4_TIGHT]
Q5  DMN3200U-7  [SOT95P245X110-3M]
R174  1k  [RESC1005X40N]
R200  1k  [RESC1005X40N]

### Nets
+1V8: R200.1
+5V: L1.2
GND: C9.2 C10.2 C11.2 C12.2 J16.1 J16.M J19.1 J19.M Q5.2(S)
FAN_PWM: Q5.1(G) R200.2
NetC9_1: C9.1 C10.1 C11.1 C12.1 J16.2 J19.2 L1.1 R174.1
NetJ16_4: J16.4 J19.4 Q5.3(D) R174.2

Not connected (* = marked no-connect by the designer): J16 3*; J19 3*; MH1 1; MH2 1; MH3 1; MH4 1; MH5 1; MH6 1; MH7 1

### Notes on the sheet
- (near C10) Connector top & bottom.
- 2-pin fan, or 3-pin fan with tach output:
  * Connect pin 2 (VCC) , pin 4 (GND).
  4-pin fan, or 3-pin fan with control input:
  * Connect pin 1 (GND), pin 2 (VCC), pin 4 (CTRL).
  If fan has tach output, connect to pin 3 (NC) to terminate header.
- (near C12) Mating connector:
  * Housing GHR-04V-S
  * Contacts SSHL-002T-P0.2
  * Crimp tool YRS-1590
- Title:
- Date:
- Rev:
- Time:
- Project:
- Sheet
- of
- License:
- Copyright © NewAE Technology Inc.
- Approved:
- NewAE.com
- File:

### Library data of the parts
C9 C11 = CCHIP-2u2-0603: 2u2, 0603; Manufacture 1: Samsung; Manufacture Part Number 1: CL10B225KP8NNNC; Component Group: Capacitor; Case-EIA: 0603; Case-Metric: 1608; Rated Voltage: 10VDC; Part Number: CCHIP-2u2-0603; Footprint: 0603; Pin Count: 2; Supplier 1: Digi-Key; Supplier Part Number 1: 1276-1134-1-ND; Value: 2u2; Mounting Technology: SMT; Component Kind: Standard; Component Type: Standard
C10 C12 = CCHIP-100n-0402: as C28 on sheet CW340_Clocks; Part Number: CCHIP-100n-0402; Footprint: 0402; Pin Count: 2; Supplier 1: Digi-Key; Supplier Part Number 1: 445-6901-1-ND; Value: 100n; Mounting Technology: SMT; Component Kind: Standard; Component Type: Standard
FID1-FID10 = FIDU-ROUND-1.0MM: ROUND FIDUCIAL; Component Group: PCB Feature; Part Number: FIDU-ROUND-1.0MM; Pin Count: 0; Component Type: Standard (No BOM)
J16 J19 = BM04B-GHS-TBT: CONN HEADER SMD 4POS 1.25MM; Manufacture 1: JST Sales America Inc.; Manufacture Part Number 1: BM04B-GHS-TBT(LF)(SN)(N); Component Group: Connector; PP Material Stack: 0; Part Number: BM04B-GHS-TBT; Footprint: Nonstandard; Pin Count: 4; Supplier 1: Digi-Key; Supplier Part Number 1: 455-1580-1-ND; Mounting Technology: SMT; RoHS: Yes; Component Kind: Standard; Component Type: Standard; PP Rotation: 0
L1 = FBCHIP-120R-0603: as L18 on sheet CW340_Clocks; Part Number: FBCHIP-120R-0603; Footprint: 0603; Pin Count: 2; Supplier 1: Digi-Key; Supplier Part Number 1: 490-3996-1-ND; Rated Power: 3A; Component Kind: Standard; Component Type: Standard; PP Rotation: 0
MH1-MH7 = MOUNT_#4_TIGHT: Machine screw 4-40 Mounting Hole; Component Group: Mechanical; PP Material Stack: 0; Part Number: MOUNT_#4_TIGHT; Pin Count: 1; Component Kind: Mechanical; Component Type: Mechanical; PP Rotation: 0
Q5 = DMN3200U-7: as Q7 on sheet CW340_FPGA_CFG; Part Number: DMN3200U-7; Component Group: MOSFET; Footprint: SOT23; Manufacture Part Number 1: DMN3200U-7; Pin Count: 3; Supplier 1: Digi-Key; Supplier Part Number 1: DMN3200U-7DICT-ND; Rated Voltage: 30V; Mounting Technology: SMT; RoHS: Yes; Component Kind: Standard; Component Type: Standard; PP Rotation: 0
R174 R200 = RCHIP-1K-0402: as R192 on sheet CW340_FPGA_CFG; Part Number: RCHIP-1K-0402; Footprint: 0402; Pin Count: 2; Supplier 1: Digi-Key; Supplier Part Number 1: 311-1.00KLRCT-ND; Value: 1k; Tolerance: 1%; Mounting Technology: SMT; Temperature Range: -55C to 155C; Component Kind: Standard; Component Type: Standard

## Sheet CW340_INPUT_POWER.SchDoc: 5V Regulator
size Letter; Organization: NewAE Technology Inc.; Address1: 1083 Queen St., Suite 196; Address2: Halifax; Address3: NS; Address4: Canada B3H 0B2; DocumentNumber: .; Revision: .; SheetNumber: 3; SheetTotal: 31; SheetApproved: Yes
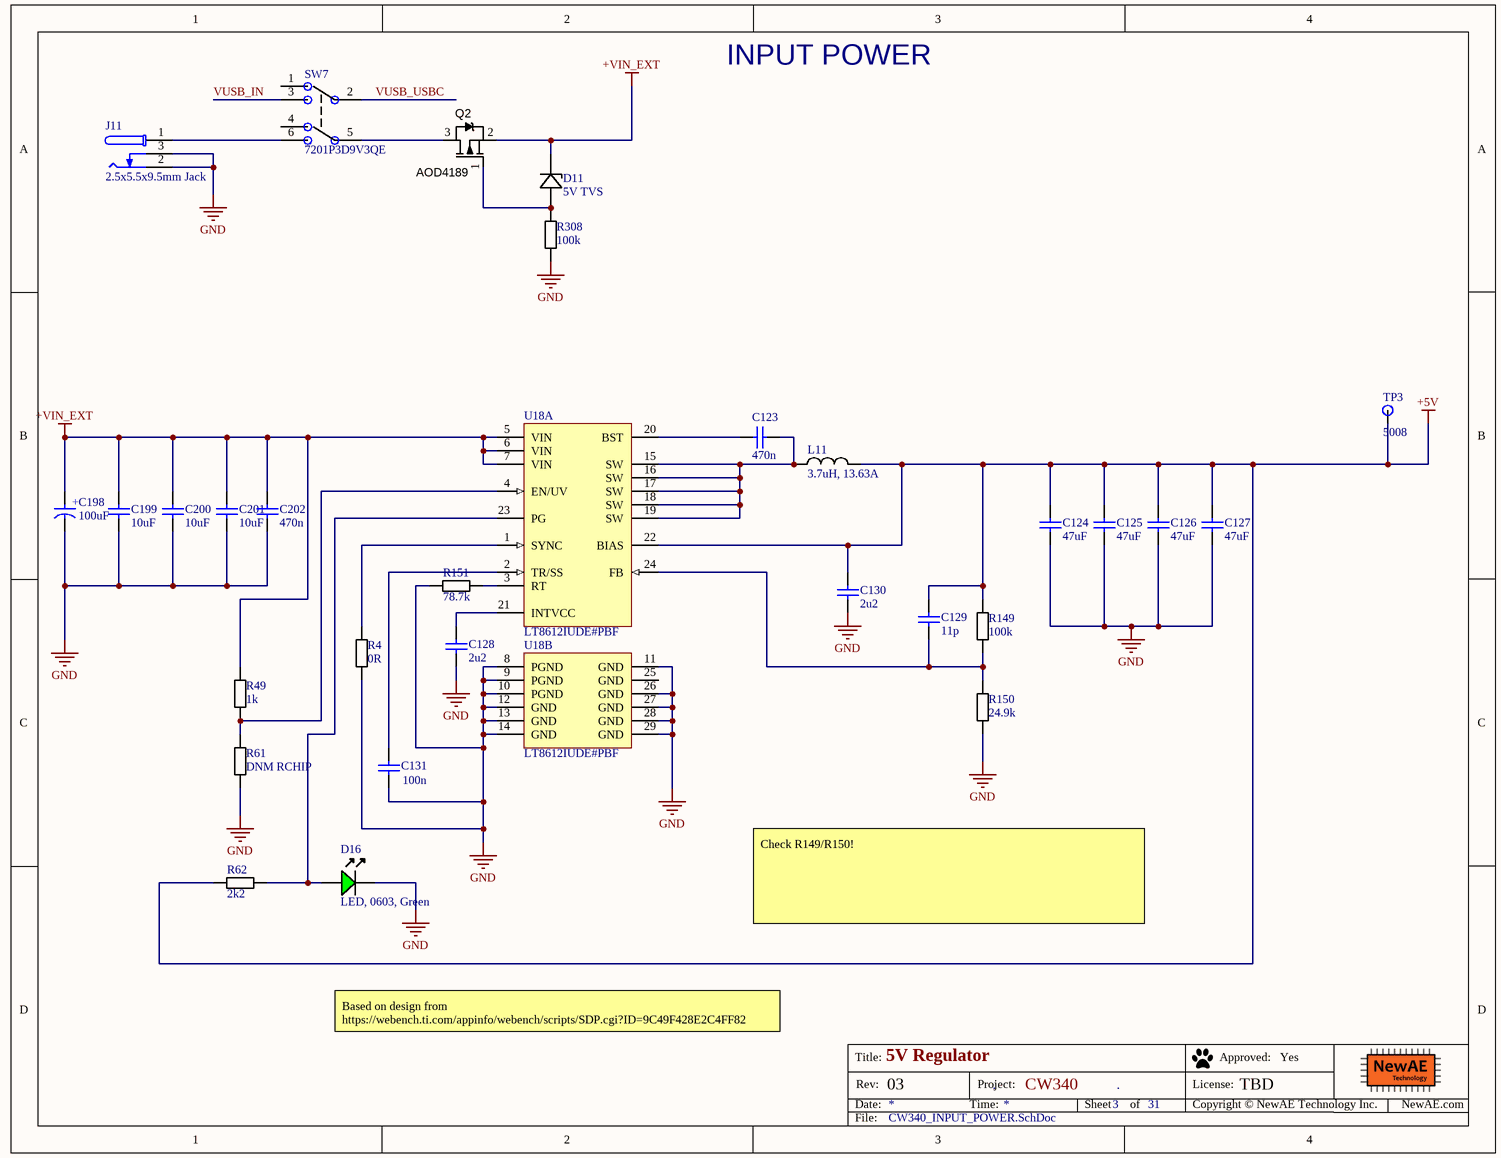
[diagram p6: CW340_INPUT_POWER.SchDoc]

### Parts
C123  470n  [CAPC0603_M]
C124  47uF  [CAPC3225X20N]
C125  47uF  [CAPC3225X20N]
C126  47uF  [CAPC3225X20N]
C127  47uF  [CAPC3225X20N]
C128  2u2  [CAPC0603_M]
C129  11p  [RESC1608X55N]
C130  2u2  [CAPC0603_M]
C131  100n  [CAPC0603_M]
C198  100uF  [CAP_AL_D6.3]
C199  10uF  [CAPC3225X20N]
C200  10uF  [CAPC3225X20N]
C201  10uF  [CAPC3225X20N]
C202  470n  [CAPC1206_M]
D11  5V TVS  [SOD-523]
D16  LED, 0603, Green  [LED-0603-GREEN]
J11  2.5x5.5x9.5mm Jack  [CUI_PJ-058BH]
L11  3.7uH, 13.63A  [MLC1565 SERIES]
Q2  AOD4189  [DPAK_TO-252AA_M]
R4  0R  [RESC1005X40N]
R49  1k  [RESC1608X55N]
R61  DNM RCHIP  [RESC1608X55N]
R62  2k2  [RESC1608X55N]
R149  100k  [RESC1608X55N]
R150  24.9k  [RESC1608X55N]
R151  78.7k  [RESC1608X55N]
R308  100k  [RESC1608X55N]
SW7  7201P3D9V3QE  [7201P3D9V3QE]
TP3  5008  [KEYSTONE5008]
U18  LT8612IUDE#PBF  [LT-UDE-28_V]  (parts A,B of 2)

### Nets
+5V: C124.1 C125.1 C126.1 C127.1 C129.1 C130.1 L11.2 R62.1 R149.1 TP3.1 U18.22(BIAS)
+VIN_EXT: C198.1 C199.1 C200.1 C201.1 C202.1 D11.1(K) Q2.2(S) R49.1 U18.5(VIN) U18.6(VIN) U18.7(VIN)
GND: C124.2 C125.2 C126.2 C127.2 C128.2 C130.2 C131.2 C198.2 C199.2 C200.2 C201.2 C202.2 D16.K J11.2 J11.3 R4.1 R61.2 R150.2 R151.1 R308.2 U18.8(PGND) U18.9(PGND) U18.10(PGND) U18.11(GND) U18.12(GND) U18.13(GND) U18.14(GND) U18.26(GND) U18.27(GND) U18.28(GND) U18.29(GND)
VUSB_USBC: SW7.2(IN)
VUSB_IN: SW7.3(IN)
NetC123_1: C123.1 U18.20(BST)
NetC123_2: C123.2 L11.1 U18.15(SW) U18.16(SW) U18.17(SW) U18.18(SW) U18.19(SW)
NetC128_1: C128.1 U18.21(INTVCC)
NetC129_2: C129.2 R149.2 R150.1 U18.24(FB)
NetC131_1: C131.1 U18.2(TR/SS)
NetD11_2: D11.2(A) Q2.1(G) R308.1
NetD16_A: D16.A R62.2 U18.23(PG)
NetJ11_1: J11.1 SW7.6(IN)
NetQ2_3: Q2.3(D) SW7.5(IN)
NetR4_2: R4.2 U18.1(SYNC)
NetR49_2: R49.2 R61.1 U18.4(EN/UV)
NetR151_2: R151.2 U18.3(RT)

Not connected (* = marked no-connect by the designer): SW7 1(IN) 4(IN); U18 25(GND)

### Notes on the sheet
- INPUT POWER
- Check R149/R150!
- Based on design from https://webench.ti.com/appinfo/webench/scripts/SDP.cgi?ID=9C49F428E2C4FF82
- Title:
- Date:
- Rev:
- Time:
- Project:
- Sheet
- of
- License:
- Copyright © NewAE Technology Inc.
- Approved:
- NewAE.com
- File:
- (in symbol Cap_35v_100uF) +

### Library data of the parts
C123 = CCHIP-470n-0603-50V: 470n, 0603, 50V; Manufacture 1: Taiyo Yuden; Manufacture Part Number 1: UMK107B7474KA-TR; Component Group: Capacitor; Case-EIA: 0603; Rated Voltage: 50VDC; Part Number: CCHIP-470n-0603-50V; Footprint: 0603; Pin Count: 2; Supplier 1: Digi-Key; Supplier Part Number 1: 587-3170-1-ND; Value: 470n; Mounting Technology: SMT; RoHS: Yes; Temperature Range: -55C to 125C; Component Kind: Standard; Component Type: Standard
C124-C127 = CCHIP-47u-1210: 47u, 10V, 1210, Ceramic; Manufacture 1: TDK Corporation; Manufacture Part Number 1: C3225X5R1A476M250AC; Component Group: Capacitor; Case-EIA: 1210; Case-Metric: 3225; Rated Voltage: 10VDC; Tolerance: 20%; Part Number: CCHIP-47u-1210; Footprint: 1210; Pin Count: 2; Supplier 1: Digi-Key; Supplier Part Number 1: 445-6711-1-ND; Value: 47uF; Mounting Technology: SMT; Temperature Range: -55C to 85C; Component Kind: Standard; Component Type: Standard
C128 = CCHIP-2u2-0603-16V: as C181 on sheet CW340_Clocks; Part Number: CCHIP-2u2-0603-16V; Footprint: 0603; Pin Count: 2; Supplier 1: Digi-Key; Supplier Part Number 1: 587-1430-1-ND; Value: 2u2; Mounting Technology: SMT; Component Kind: Standard; Component Type: Standard
C129 = CCHIP-11P-0603-50V: CAP CER 11PF 50V C0G/NP0 0603; Manufacture 1: Murata Electronics North America; Manufacture Part Number 1: GRM1885C1H510JA01D; Component Group: Capacitor; Case-EIA: 0603; Case-Metric: 1608; Tolerance: ±5%; PP Material Stack: 0; Part Number: CCHIP-11P-0603-50V; Footprint: 0603; Pin Count: 2; Value: 11p; Rated Voltage: 50V; Mounting Technology: SMT; Component Kind: Standard; Component Type: Standard; PP Rotation: 0; Supplier 1: Arrow Electronics; Supplier Part Number 1: GRM1885C1H110JA01D
C130 = CCHIP-2u2-0603: as C9 on sheet CW340_HEATSINK_FAN; Part Number: CCHIP-2u2-0603; Footprint: 0603; Pin Count: 2; Supplier 1: Digi-Key; Supplier Part Number 1: 1276-1134-1-ND; LCSC Equivalent: C57895; Value: 2u2; Mounting Technology: SMT; Component Kind: Standard; Component Type: Standard
C131 = CCHIP-100n-0603: 100n, 0603; Manufacture 1: Kemet; Manufacture Part Number 1: C0603C104K5RACTU; Component Group: Capacitor; Case-EIA: 0603; Case-Metric: 1608; Rated Voltage: 50VDC; Part Number: CCHIP-100n-0603; Footprint: 0603; Pin Count: 2; Supplier 1: Digi-Key; Supplier Part Number 1: 399-5089-2-ND; LCSC Equivalent: C1591; Value: 100n; Mounting Technology: SMT; Component Kind: Standard; Component Type: Standard
C198 = Cap_35v_100uF: CAP ALUM 100UF 20% 35V RADIAL; Manufacture 1: Panasonic Electronic Components; Manufacture Part Number 1: ECA-1VM101; Component Group: Capacitor; PP Material Stack: 0; Part Number: Cap_35v_100uF; Pin Count: 2; Supplier 1: Digi-Key; Supplier Part Number 1: P5165-ND; Value: 100uF; Mounting Technology: Through-hole; RoHS: Yes; Component Kind: Standard; Component Type: Standard; PP Rotation: 0
C199-C201 = CCHIP-10u-1210-50V: 10u, 50V, 1210, Ceramic; Manufacture 1: Samsung Electro-Mechanics; Manufacture Part Number 1: CL32B106KBJNNWE; Component Group: Capacitor; Case-EIA: 1210; Case-Metric: 3225; Tolerance: 10%; Part Number: CCHIP-10u-1210-50V; Footprint: 1210; Pin Count: 2; Supplier 1: Digi-Key; Supplier Part Number 1: 1276-3388-1-ND; Value: 10uF; Rated Voltage: 50V; Mounting Technology: SMT; Temperature Range: -55C to 85C; Component Kind: Standard; Component Type: Standard
C202 = CCHIP-470n-1206-100V: 470n, 1206, 100V; Manufacture 1: TDK Corporation; Manufacture Part Number 1: C3216X7R2A474K160AA; Component Group: Capacitor; Tolerance: 10%; PP Material Stack: 0; Part Number: CCHIP-470n-1206-100V; Footprint: 1206; Pin Count: 2; Supplier 1: Digi-Key; Supplier Part Number 1: 445-2284-1-ND; Value: 470n; Mounting Technology: SMT; Component Kind: Standard; Component Type: Standard; PP Rotation: 0
D11 = VESD05B1-02V-G3-08: TVS DIODE 1VSO 5VBD SOD523; Manufacture 1: Vishay; PP Material Stack: 0; Part Number: VESD05B1-02V-G3-08; Component Group: Diode; Manufacture Part Number 1: VESD05B1-02V-G3-08; Pin Count: 2; Supplier 1: Digi-Key; Supplier Part Number 1: VESD05B1-02V-G3-08GICT-ND; Mounting Technology: SMT; RoHS: Yes; Component Kind: Standard; Component Type: Standard; PP Rotation: 0
D16 = LEDCHIP_0603_GREEN: as D6 on sheet CW340_FPGA_CFG; Part Number: LEDCHIP_0603_GREEN; Pin Count: 2; Supplier 1: Digi-Key; Supplier Part Number 1: 754-1116-1-ND; Mounting Technology: SMT; Component Kind: Standard; Component Type: Standard
J11 = CUI_PJ-058BH: CONN PWR JACK 2.5X5.5MM SOLDER; Manufacture 1: CUI Inc.; Component Group: Connector; Rated Power: 5A; PP Material Stack: 0; Part Number: CUI_PJ-058BH; Manufacture Part Number 1: PJ-058BH; Pin Count: 3; Supplier 1: Digi-Key; Supplier Part Number 1: CP-058BH-ND; Mounting Technology: Through-hole; RoHS: Yes; Component Kind: Standard; Component Type: Standard; PP Rotation: 0
L11 = MLC1565-372MLB: Manufacture 1: Coilcraft; Component Group: Inductor; Value: 3.7uH, 13A; PP Material Stack: 0; Part Number: MLC1565-372MLB; Footprint: MLC1565; Manufacture Part Number 1: MLC1565-372MLB; Pin Count: 2; Supplier 1: Mouser; Mounting Technology: SMT; RoHS: Yes; Component Kind: Standard; Component Type: Standard; PP Rotation: 0
Q2 = AOD4189: MOSFET P-CH 40V 40A TO252; Manufacture 1: Alpha & Omega Semi; Part Number: AOD4189; Component Group: MOSFET; Footprint: DPAK; Manufacture Part Number 1: AOD4189; Pin Count: 3; Supplier 1: Digi-Key; Supplier Part Number 1: 785-1351-1-ND; Rated Power: 40A; Rated Voltage: 40V; Mounting Technology: SMT; RoHS: Yes; Component Kind: Standard; Component Type: Standard
R4 = RCHIP-0R-0402: Manufacture 1: Yageo; Manufacture Part Number 1: RC0402FR-070RL; Component Group: Resistor; Case-EIA: 0402; Case-Metric: 1005; Part Number: RCHIP-0R-0402; Footprint: 0402; Pin Count: 2; Value: 0R; Component Kind: Standard; Component Type: Standard; Supplier 1: Digi-Key; Supplier Part Number 1: 311-0.0LRCT-ND
R49 = RCHIP-1K-0603: 1k res, 0603, 1%, 1/10W; Manufacture 1: Yageo; Manufacture Part Number 1: RC0603FR-071KL; Component Group: Resistor; Case-EIA: 0603; Case-Metric: 1608; Rated Power: 0.1W; Rated Voltage: 75VDC; Part Number: RCHIP-1K-0603; Footprint: 0603; Pin Count: 2; Supplier 1: Digi-Key; Supplier Part Number 1: 311-1.00KHRCT-ND; Value: 1k; Tolerance: 1%; Mounting Technology: SMT; Temperature Range: -55C to 155C; Component Kind: Standard; Component Type: Standard
R61 = RCHIP-DNM-0603: Do Not Mount Resistor; Case-EIA: 0603; Case-Metric: 1608; Part Number: RCHIP-DNM-0603; Component Group: Resistor; Footprint: 0603; Pin Count: 2; Mounting Technology: SMT; Component Kind: Standard; Component Type: Standard
R62 = RCHIP-2K2-0603: 2k2 res, 0603, 1%, 1/10W; Manufacture 1: Yageo; Manufacture Part Number 1: RC0603FR-072K2L; Component Group: Resistor; Case-EIA: 0603; Case-Metric: 1608; Rated Power: 0.1W; Rated Voltage: 75VDC; Part Number: RCHIP-2K2-0603; Footprint: 0603; Pin Count: 2; Supplier 1: Digi-Key; Supplier Part Number 1: 311-2.20KHRCT-ND; Value: 2k2; Tolerance: 1%; Mounting Technology: SMT; Temperature Range: -55C to 155C; Component Kind: Standard; Component Type: Standard
R149 R308 = RCHIP-100K-0603: 100k res, 0603, 1%, 1/10W; Manufacture 1: Yageo; Manufacture Part Number 1: RC0603FR-07100KL; Component Group: Resistor; Case-EIA: 0603; Case-Metric: 1608; Rated Power: 0.1W; Rated Voltage: 75VDC; Part Number: RCHIP-100K-0603; Footprint: 0603; Pin Count: 2; Supplier 1: Digi-Key; Supplier Part Number 1: 311-100KHRCT-ND; Value: 100k; Tolerance: 1%; Mounting Technology: SMT; Temperature Range: -55C to 155C; Component Kind: Standard; Component Type: Standard
R150 = RCHIP-24K9-0603: 24k9 res, 0603, 1%, 1/10W; Manufacture 1: Yageo; Manufacture Part Number 1: RC0603FR-0724K9L; Component Group: Resistor; Case-EIA: 0603; Case-Metric: 1608; Rated Power: 0.1W; Rated Voltage: 75VDC; PP Notes: Standard; Part Number: RCHIP-24K9-0603; Footprint: 0603; Pin Count: 2; Supplier 1: Digi-Key; Supplier Part Number 1: 311-24.9KHRCT-ND; Value: 24.9k; Tolerance: 1%; Component Kind: -55C to 155C; Component Type: Standard; Orientation: SMT
R151 = RCHIP-78k7-0603: 78k7 res, 0603, 1%, 1/10W; Manufacture 1: Yageo; Manufacture Part Number 1: RC0603FR-078K7L; Component Group: Resistor; Case-EIA: 0603; Case-Metric: 1608; Rated Power: 0.1W; Rated Voltage: 75VDC; Part Number: RCHIP-78k7-0603; Footprint: 0603; Pin Count: 2; Supplier 1: Digi-Key; Value: 78.7k; Tolerance: 1%; Mounting Technology: SMT; Temperature Range: -55C to 155C; Component Kind: Standard; Component Type: Standard; Supplier Part Number 1: 311-78.7KHRCT-ND
SW7 = 7201P3D9V3QE: DPDT, Switch, TH; Manufacture 1: CK Switch; PP Material Stack: 0; Part Number: 7201P3D9V3QE; Component Group: Switch; Manufacture Part Number 1: 7201P3D9V3QE; Pin Count: 8; Supplier 1: Digi-Key; Component Kind: Standard; Component Type: Standard; PP Rotation: 0; PP Rotation1: 0
TP3 = KEYSTONE_5008: TEST POINT PC COMPACT .063"D ORG; Part Number: KEYSTONE_5008; Component Group: Test Point; Pin Count: 1; Supplier 1: Digi-Key; Supplier Part Number 1: 36-5008-ND; Mounting Technology: Through-hole; Component Kind: Standard; Component Type: Standard
U18 = CMP-0492-02659-1: Synchronous Step-Down Regulator, 3.4 to 42 V, -40 to 125 degC, 28-Pin PQFN (UDE), RoHS, Tube; Manufacturer: Linear Technology; VOUT: 0.97 to 41.6 V; Number of Outputs: 1; fSW: 0.2 to 2.2 MHz; IOUT: 6 A; DatasheetVersion: Dec-13; VIN: 3.4 to 42 V; RoHS: TRUE; Temperature Range: -40 to 125 degC; ComponentLink2URL: http://cds.linear.com/docs/en/datasheet/8612f.pdf; PackageVersion: Rev. Ã˜; PackageDescription: 28-Pin Plastic Quad Flat No-lead Package, Body 6 x 3 mm, Pitch 0.5 mm; Mounting Technology: Surface Mount; ComponentLink1Description: Manufacturer URL; ComponentLink3Description: Package Specification; ComponentLink2Description: Datasheet; ComponentLink1URL: http://www.linear.com/; ComponentLink3URL: http://cds.linear.com/docs/en/packaging/05081926_0_UDE28.pdf; PartNumber: LT8612IUDE#PBF; Packing: Tube

## Sheet CW340_PSU_VCCIO.SchDoc: VCCIO Fixed Supplies
size Letter; Organization: NewAE Technology Inc.; Address1: 1083 Queen St., Suite 196; Address2: Halifax; Address3: NS; Address4: Canada B3H 0B2; DocumentNumber: .; Revision: .; SheetNumber: 22; SheetTotal: 31; SheetApproved: Yes
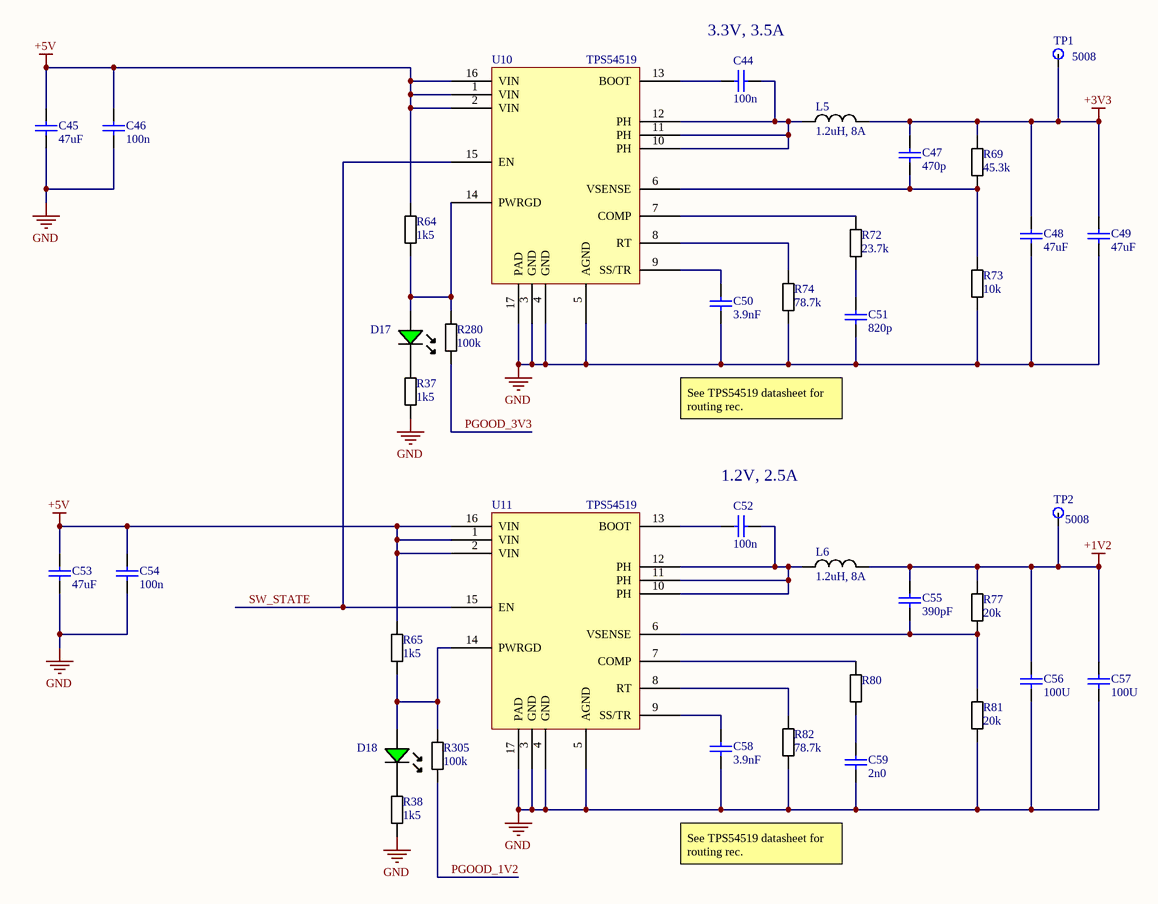
[diagram p7: CW340_PSU_VCCIO.SchDoc]

### Parts
C44  100n  [CAPC0603_M]
C45  47uF  [CAPC3225X20N]
C46  100n  [CAPC0603_M]
C47  470p  [RESC1608X55N]
C48  47uF  [CAPC3225X20N]
C49  47uF  [CAPC3225X20N]
C50  3.9nF  [CAPC0603_M]
C51  820p  [RESC1608X55N]
C52  100n  [CAPC0603_M]
C53  47uF  [CAPC3225X20N]
C54  100n  [CAPC0603_M]
C55  390pF  [CAPC0603_M]
C56  100U  [CAPC1206_M]
C57  100U  [CAPC1206_M]
C58  3.9nF  [CAPC0603_M]
C59  2n0  [CAPC0603_M]
D17  LED, 0603, Green  [LED-0603-GREEN]  (value not drawn)
D18  LED, 0603, Green  [LED-0603-GREEN]  (value not drawn)
L5  1.2uH, 8A  [XAL5030-122]
L6  1.2uH, 8A  [XAL5030-122]
R37  1k5  [RESC1608X55N]
R38  1k5  [RESC1608X55N]
R64  1k5  [RESC1608X55N]
R65  1k5  [RESC1608X55N]
R69  45.3k  [RESC1608X55N]
R72  23.7k  [RESC1608X55N]
R73  10k  [RESC1608X55N]
R74  78.7k  [RESC1608X55N]
R77  20k  [RESC1608X55N]
R80  (no value)  [RESC1608X55N]
R81  20k  [RESC1608X55N]
R82  78.7k  [RESC1608X55N]
R280  100k  [RESC1608X55N]
R305  100k  [RESC1608X55N]
TP1  5008  [KEYSTONE5008]
TP2  5008  [KEYSTONE5008]
U10  TPS54519  [QFN50P300X300X80_HS-17N]
U11  TPS54519  [QFN50P300X300X80_HS-17N]

### Nets
+1V2: C55.1 C56.1 C57.1 L6.2 R77.1 TP2.1
+3V3: C47.2 C48.1 C49.1 L5.2 R69.1 TP1.1
+5V: C45.1 C46.2 C53.1 C54.2 R64.1 R65.1 U10.1(VIN) U10.2(VIN) U10.16(VIN) U11.1(VIN) U11.2(VIN) U11.16(VIN)
GND: C45.2 C46.1 C48.2 C49.2 C50.2 C51.2 C53.2 C54.1 C56.2 C57.2 C58.2 C59.2 R37.2 R38.2 R73.2 R74.2 R81.2 R82.2 U10.3(GND) U10.4(GND) U10.5(AGND) U10.17(PAD) U11.3(GND) U11.4(GND) U11.5(AGND) U11.17(PAD)
PGOOD_1V2: R305.2
PGOOD_3V3: R280.2
SW_STATE: U10.15(EN) U11.15(EN)
NetC44_1: C44.1 U10.13(BOOT)
NetC44_2: C44.2 L5.1 U10.10(PH) U10.11(PH) U10.12(PH)
NetC47_1: C47.1 R69.2 R73.1 U10.6(VSENSE)
NetC50_1: C50.1 U10.9(SS/TR)
NetC51_1: C51.1 R72.2
NetC52_1: C52.1 U11.13(BOOT)
NetC52_2: C52.2 L6.1 U11.10(PH) U11.11(PH) U11.12(PH)
NetC55_2: C55.2 R77.2 R81.1 U11.6(VSENSE)
NetC58_1: C58.1 U11.9(SS/TR)
NetC59_1: C59.1 R80.2
NetD17_A: D17.A R64.2 R280.1 U10.14(PWRGD)
NetD17_K: D17.K R37.1
NetD18_A: D18.A R65.2 R305.1 U11.14(PWRGD)
NetD18_K: D18.K R38.1
NetR72_1: R72.1 U10.7(COMP)
NetR74_1: R74.1 U10.8(RT)
NetR80_1: R80.1 U11.7(COMP)
NetR82_1: R82.1 U11.8(RT)

### Notes on the sheet
- (near C44) 3.3V, 3.5A
- See TPS54519 datasheet for routing rec.
- (near C52) 1.2V, 2.5A
- Title:
- Date:
- Rev:
- Time:
- Project:
- Sheet
- of
- License:
- Copyright © NewAE Technology Inc.
- Approved:
- NewAE.com
- File:

### Library data of the parts
C44 C46 C52 C54 = CCHIP-100n-0603: as C131 on sheet CW340_INPUT_POWER; Part Number: CCHIP-100n-0603; Footprint: 0603; Pin Count: 2; Supplier 1: Digi-Key; Supplier Part Number 1: 399-5089-2-ND; LCSC Equivalent: C1591; Value: 100n; Mounting Technology: SMT; Component Kind: Standard; Component Type: Standard
C45 C48 C49 C53 = CCHIP-47u-1210: as C124 on sheet CW340_INPUT_POWER; Part Number: CCHIP-47u-1210; Footprint: 1210; Pin Count: 2; Supplier 1: Digi-Key; Supplier Part Number 1: 445-6711-1-ND; Value: 47uF; Mounting Technology: SMT; Temperature Range: -55C to 85C; Component Kind: Standard; Component Type: Standard
C47 = CCHIP-470P-0603-100V: CAP CER 470PF 100V X7R 0603; Manufacture 1: Murata Electronics North America; Manufacture Part Number 1: GRM188R72A471KA01D; Component Group: Capacitor; Case-EIA: 0603; Case-Metric: 1608; Tolerance: ±10%; PP Material Stack: 0; Part Number: CCHIP-470P-0603-100V; Footprint: 0603; Pin Count: 2; Supplier 1: Digi-Key; Supplier Part Number 1: 490-1467-1-ND; Value: 470p; Rated Voltage: 100V; Mounting Technology: SMT; Component Kind: Standard; Component Type: Standard; PP Rotation: 0
C50 C58 = CCHIP-3n9-0603: 3n9, 0603; Manufacture 1: Murata; Manufacture Part Number 1: GCM1885C1H392FA16J; Component Group: Capacitor; Case-EIA: 0603; Case-Metric: 1608; PP Material Stack: 0; Tolerance: 1%; Part Number: CCHIP-3n9-0603; Footprint: 0603; Pin Count: 2; Value: 3.9nF; Mounting Technology: SMT; Component Kind: Standard; Component Type: Standard; PP Rotation: 0; Supplier 1: Digi-Key; Supplier Part Number 1: 490-GCM1885C1H392FA16JCT-ND
C51 = CCHIP-820P-0603-100V: CAP CER 820PF 100V X7R 0603; Manufacture 1: Murata Electronics North America; Manufacture Part Number 1: GRM188R72A821KA01D; Component Group: Capacitor; Case-EIA: 0603; Case-Metric: 1608; Tolerance: ±10%; PP Material Stack: 0; Part Number: CCHIP-820P-0603-100V; Footprint: 0603; Pin Count: 2; Supplier 1: Digi-Key; Supplier Part Number 1: 490-1471-1-ND; Value: 820p; Rated Voltage: 100V; Mounting Technology: SMT; Component Kind: Standard; Component Type: Standard; PP Rotation: 0
C55 = CCHIP-390p-0603-C0G: 390p, 0603, C0G/NP0; Manufacture Part Number 1: GCM1885C2A391JA16D; Component Group: Capacitor; Case-EIA: 0603; Case-Metric: 1608; Rated Voltage: 50V; Tolerance: 5%; PP Material Stack: 0; Part Number: CCHIP-390p-0603-C0G; Footprint: 0603; Pin Count: 2; Supplier 1: Digi-Key; Value: 390pF; Mounting Technology: SMT; Component Kind: Standard; Component Type: Standard; PP Rotation: 0; Supplier Part Number 1: 490-17768-1-ND
C56 C57 = CCHIP-100u-1206-6.3v: CAP CER 100UF 6.3V X5R 1206; Manufacture 1: Murata Electronics; Manufacture Part Number 1: GRM31CR60J107ME39L; Component Group: Capacitor; Case-EIA: 1206; Case-Metric: 3216; Rated Voltage: 6.3VDC; Part Number: CCHIP-100u-1206-6.3v; Footprint: 1206; Pin Count: 2; Supplier 1: Digi-Key; Supplier Part Number 1: 490-4539-2-ND; Value: 100U; Mounting Technology: SMT; Component Kind: Standard; Component Type: Standard
C59 = CCHIP-2n-0603-C0G: 2n, 0603, C0G/NP0; Manufacture Part Number 1: GCM1885C1H202FA16J; Component Group: Capacitor; Case-EIA: 0603; Case-Metric: 1608; Rated Voltage: 50V; Tolerance: 1%; Part Number: CCHIP-2n-0603-C0G; Footprint: 0603; Pin Count: 2; Supplier 1: Digi-Key; Value: 2n0; Mounting Technology: SMT; Component Kind: Standard; Component Type: Standard; Supplier Part Number 1: 490-GCM1885C1H202FA16JCT-ND
D17 D18 = LEDCHIP_0603_GREEN: as D6 on sheet CW340_FPGA_CFG; Part Number: LEDCHIP_0603_GREEN; Pin Count: 2; Supplier 1: Digi-Key; Supplier Part Number 1: 754-1116-1-ND; Mounting Technology: SMT; Component Kind: Standard; Component Type: Standard
L5 L6 = XAL5030-122: 1.2uH, 8A RMS, 12A SAT; Manufacture 1: Coilcraft; Manufacture Part Number 1: XAL5030-122MEB; Component Group: Inductor; PP Material Stack: 0; Part Number: XAL5030-122; Footprint: XAL5030; Pin Count: 2; Supplier 1: Mouser; Value: 1.2uH, 8A; Mounting Technology: SMT; Component Kind: Standard; Component Type: Standard; PP Rotation: 0
R37 R38 R64 R65 = RCHIP-1K5-0603: 1k5 res, 0603, 1%, 1/10W; Manufacture 1: Yageo; Manufacture Part Number 1: RC0603FR-071K5L; Component Group: Resistor; Case-EIA: 0603; Case-Metric: 1608; Rated Power: 0.1W; Rated Voltage: 75VDC; Part Number: RCHIP-1K5-0603; Footprint: 0603; Pin Count: 2; Supplier 1: Digi-Key; Supplier Part Number 1: 311-1.50KHRCT-ND; Value: 1k5; Tolerance: 1%; Mounting Technology: SMT; Temperature Range: -55C to 155C; Component Kind: Standard; Component Type: Standard
R69 = RCHIP-45K3-0603: 45k3 res, 0603, 1%, 1/10W; Manufacture 1: Yageo; Manufacture Part Number 1: RC0603FR-0745K3L; Component Group: Resistor; Case-EIA: 0603; Case-Metric: 1608; Rated Power: 0.1W; Rated Voltage: 75VDC; Part Number: RCHIP-45K3-0603; Footprint: 0603; Pin Count: 2; Supplier 1: Digi-Key; Supplier Part Number 1: 311-45.3KHRCT-ND; Value: 45.3k; Tolerance: 1%; Mounting Technology: SMT; Temperature Range: -55C to 155C; Component Kind: Standard; Component Type: Standard
R72 = RCHIP-23k7-0603: 23k7 res, 0603, 1%, 1/10W; Manufacture 1: Yageo; Manufacture Part Number 1: RC0603FR-0723K7L; Component Group: Resistor; Case-EIA: 0603; Case-Metric: 1608; Rated Power: 0.1W; Rated Voltage: 75VDC; Part Number: RCHIP-23k7-0603; Footprint: 0603; Pin Count: 2; Supplier 1: Digi-Key; Value: 23.7k; Tolerance: 1%; Mounting Technology: SMT; Temperature Range: -55C to 155C; Component Kind: Standard; Component Type: Standard; Supplier Part Number 1: 311-23.7KHRCT-ND
R73 = RCHIP-10K-0603: 10k res, 0603, 1%, 1/10W; Manufacture 1: Yageo; Manufacture Part Number 1: RC0603FR-0710KL; Component Group: Resistor; Case-EIA: 0603; Case-Metric: 1608; Rated Power: 0.1W; Rated Voltage: 75VDC; Part Number: RCHIP-10K-0603; Footprint: 0603; Pin Count: 2; Supplier 1: Digi-Key; Supplier Part Number 1: 311-10.0KHRCT-ND; Value: 10k; Tolerance: 1%; Mounting Technology: SMT; Temperature Range: -55C to 155C; Component Kind: Standard; Component Type: Standard
R74 R82 = RCHIP-78k7-0603: as R151 on sheet CW340_INPUT_POWER; Part Number: RCHIP-78k7-0603; Footprint: 0603; Pin Count: 2; Supplier 1: Digi-Key; Value: 78.7k; Tolerance: 1%; Mounting Technology: SMT; Temperature Range: -55C to 155C; Component Kind: Standard; Component Type: Standard; Supplier Part Number 1: 311-78.7KHRCT-ND
R77 R81 = RCHIP-20K-0603: 20k res, 0603, 1%, 1/10W; Manufacture 1: Yageo; Manufacture Part Number 1: RC0603FR-0720KL; Component Group: Resistor; Case-EIA: 0603; Case-Metric: 1608; Rated Power: 0.1W; Rated Voltage: 75VDC; Part Number: RCHIP-20K-0603; Footprint: 0603; Pin Count: 2; Supplier 1: Digi-Key; Supplier Part Number 1: 311-20.0KHRCT-ND; Value: 20k; Tolerance: 1%; Mounting Technology: SMT; Temperature Range: -55C to 155C; Component Kind: Standard; Component Type: Standard
R80 = RCHIP-12k1-0603: 12k1 res, 0603, 1%, 1/10W; Manufacture 1: Yageo; Manufacture Part Number 1: RC0603FR-0712K1L; Component Group: Resistor; Case-EIA: 0603; Case-Metric: 1608; Rated Power: 0.1W; Rated Voltage: 75VDC; Part Number: RCHIP-12k1-0603; Footprint: 0603; Pin Count: 2; Supplier 1: Digi-Key; Tolerance: 1%; Mounting Technology: SMT; Temperature Range: -55C to 155C; Component Kind: Standard; Component Type: Standard; Supplier Part Number 1: 311-12.1KHRCT-ND
R280 R305 = RCHIP-100K-0603: as R149 on sheet CW340_INPUT_POWER; Part Number: RCHIP-100K-0603; Footprint: 0603; Pin Count: 2; Supplier 1: Digi-Key; Supplier Part Number 1: 311-100KHRCT-ND; Value: 100k; Tolerance: 1%; Mounting Technology: SMT; Temperature Range: -55C to 155C; Component Kind: Standard; Component Type: Standard
TP1 TP2 = KEYSTONE_5008: TEST POINT PC COMPACT .063"D ORG; Part Number: KEYSTONE_5008; Component Group: Test Point; Pin Count: 1; Supplier 1: Digi-Key; Supplier Part Number 1: 36-5008-ND; Mounting Technology: Through-hole; Component Kind: Standard; Component Type: Standard
U10 U11 = TPS54519: 6V Input, 5A, SMPS; Manufacture 1: Texas Instruments; Component Group: Analog IC; PP Material Stack: 0; Part Number: TPS54519; Footprint: 16-QFN; Manufacture Part Number 1: TPS54519; Pin Count: 17; Component Kind: Standard; Component Type: Standard; PP Rotation: 0; Mounting Technology: SMT